# Altium project RZS_TestBench.PrjPcb
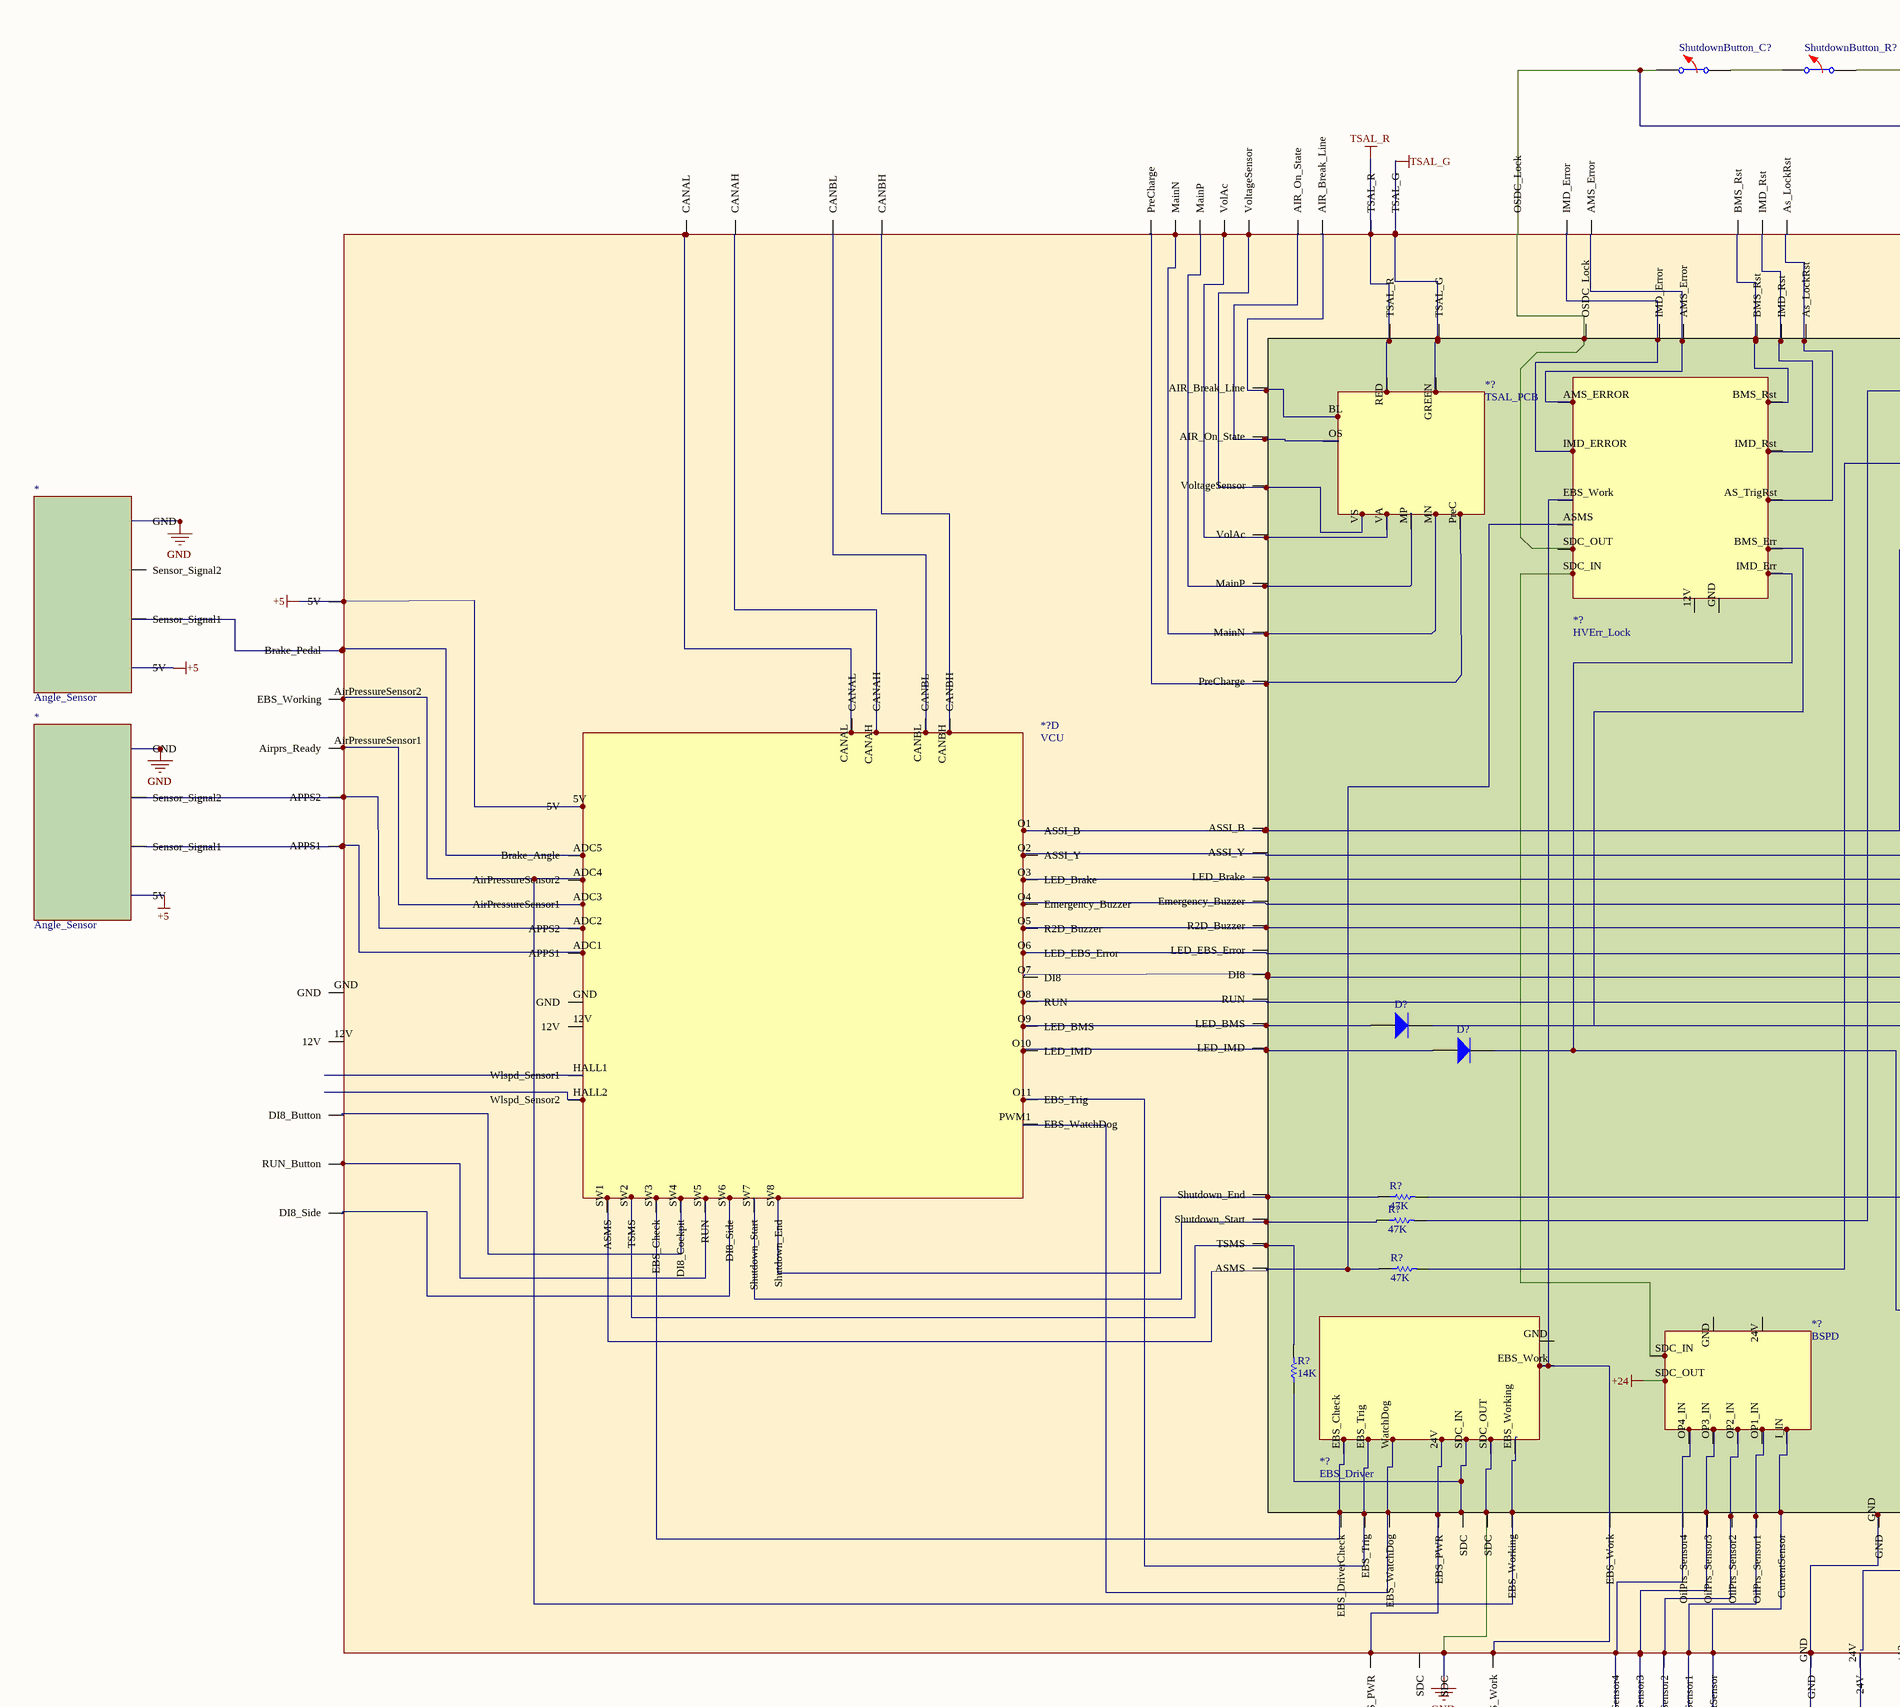
[diagram p0: Bench.SchDoc, top left]
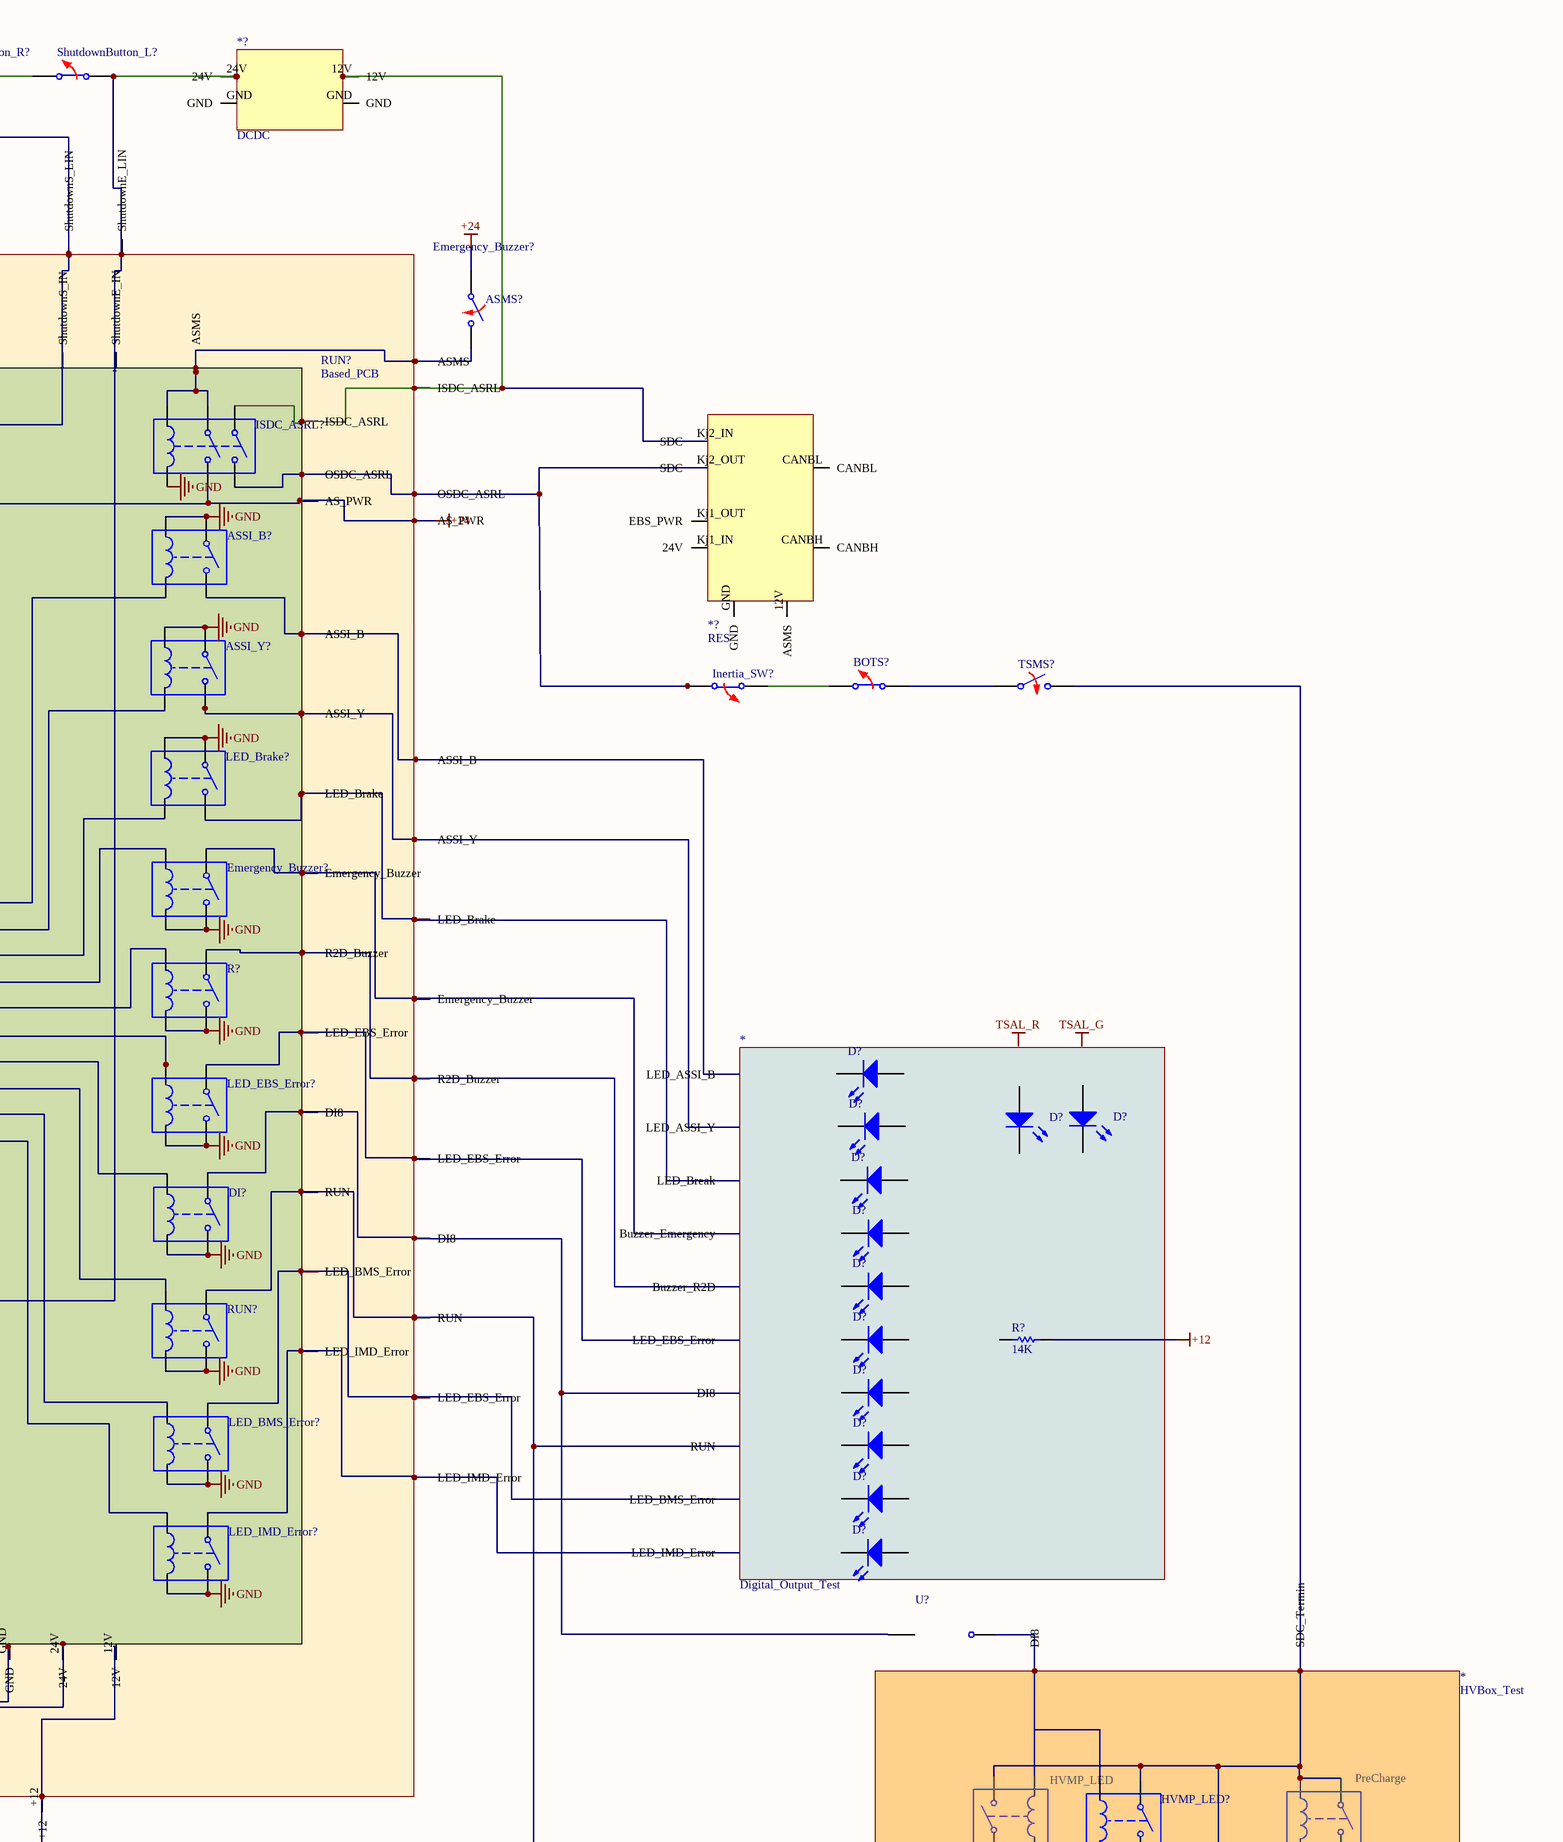
[diagram p1: Bench.SchDoc, top right]
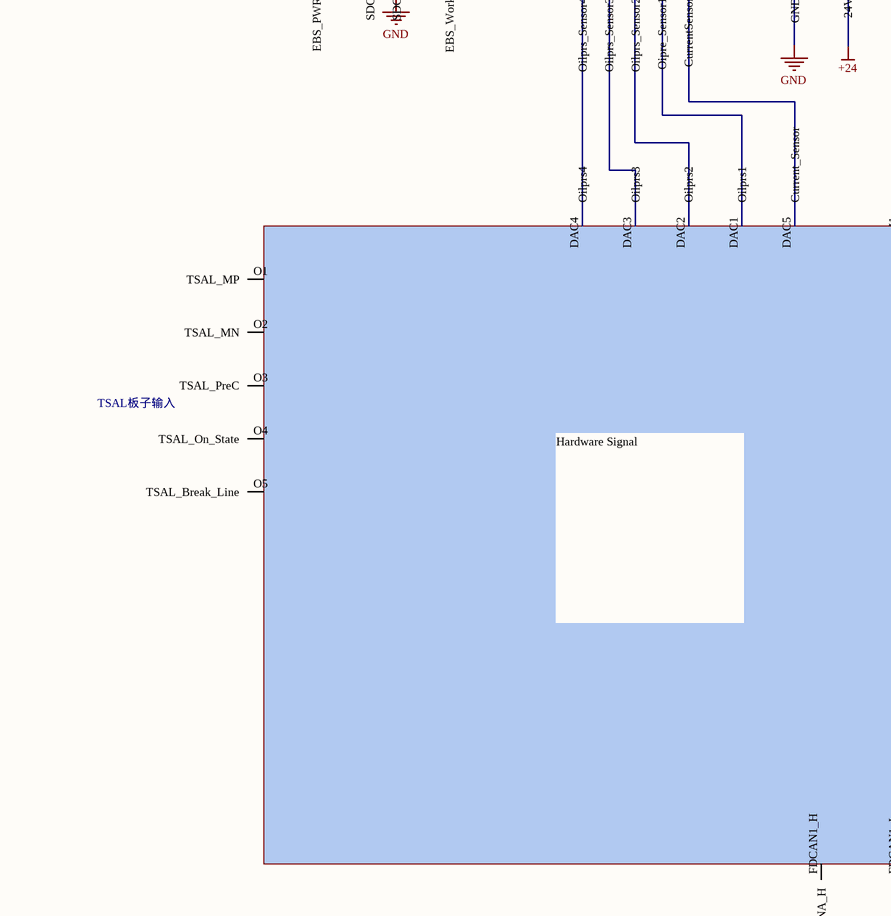
[diagram p2: Bench.SchDoc, bottom left]
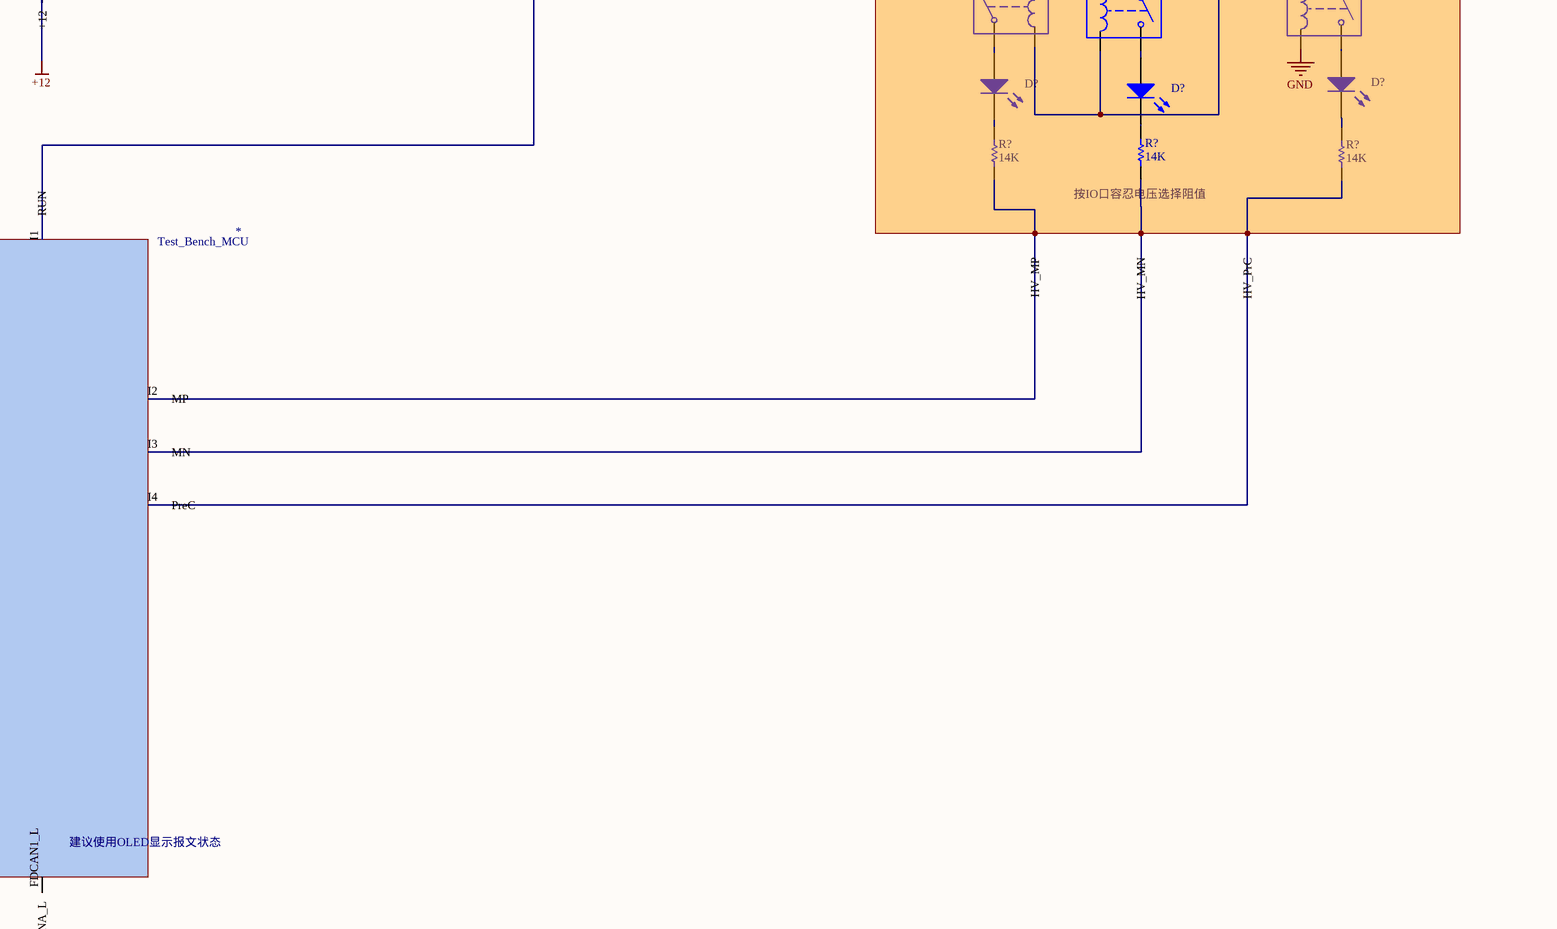
[diagram p3: Bench.SchDoc, bottom right]
7 sheets, 251 parts. Net scope: flat (ports and power ports of the same name join across sheets).
Sheets:
  Bench.SchDoc
  箱外驱动系统.SchDoc
  电池箱内部原理图.SchDoc
  安全回路.SchDoc
  充电安全回路.SchDoc
  TSAL分布图.SchDoc
  电气拓扑.SchDoc

## Sheet Bench.SchDoc
size 800 x 800 mm; SheetNumber: 1; SheetTotal: 1

### Parts
(Parts that share a designator on the sheet are numbered #1, #2 ... from top to bottom, then left to right.)
*#1  Angle_Sensor
*#2  Angle_Sensor
*#3  Digital_Output_Test
*#4  HVBox_Test
*#5  Test_Bench_MCU
*?#1  DCDC
*?#2  RES
*?#3  TSAL_PCB
*?#4  HVErr_Lock
*?#5  VCU  (part D of 4)
*?#6  BSPD
*?#7  EBS_Driver
ASMS?  Switch Normally Opened  (value not drawn)
ASSI_B?  Single-Pole, Single-Throw Normally Opened Relay  (value not drawn)
ASSI_Y?  Single-Pole, Single-Throw Normally Opened Relay  (value not drawn)
BOTS?  Switch Normally Closed  (value not drawn)
D?#1  Light-Emitting Diode  (value not drawn)
D?#2  Light-Emitting Diode  (value not drawn)
D?#3  Light-Emitting Diode  (value not drawn)
D?#4  Diode  (value not drawn)
D?#5  Light-Emitting Diode  (value not drawn)
D?#6  Diode  (value not drawn)
D?#7  Light-Emitting Diode  (value not drawn)
D?#8  Light-Emitting Diode  (value not drawn)
D?#9  Light-Emitting Diode  (value not drawn)
D?#10  Light-Emitting Diode  (value not drawn)
D?#11  Light-Emitting Diode  (value not drawn)
D?#12  Light-Emitting Diode  (value not drawn)
D?#13  Light-Emitting Diode  (value not drawn)
D?#14  Light-Emitting Diode  (value not drawn)
D?#15  Light-Emitting Diode  (value not drawn)
D?#16  Light-Emitting Diode  (value not drawn)
D?#17  Light-Emitting Diode  (value not drawn)
DI?  Single-Pole, Single-Throw Normally Opened Relay  (value not drawn)
Emergency_Buzzer?#1  Single-Pole, Single-Throw Normally Opened Relay  (value not drawn)
Emergency_Buzzer?#2  (no value)
HVMP_LED  Single-Pole, Single-Throw Normally Opened Relay  (value not drawn)
HVMP_LED?  Single-Pole, Single-Throw Normally Opened Relay  (value not drawn)
Inertia_SW?  Switch Normally Closed  (value not drawn)
ISDC_ASRL?  Double-Pole, Single-Throw Relay  (value not drawn)
LED_BMS_Error?  Single-Pole, Single-Throw Normally Opened Relay  (value not drawn)
LED_Brake?  Single-Pole, Single-Throw Normally Opened Relay  (value not drawn)
LED_EBS_Error?  Single-Pole, Single-Throw Normally Opened Relay  (value not drawn)
LED_IMD_Error?  Single-Pole, Single-Throw Normally Opened Relay  (value not drawn)
PreCharge  Single-Pole, Single-Throw Normally Opened Relay  (value not drawn)
R?#1  Single-Pole, Single-Throw Normally Opened Relay  (value not drawn)
R?#2  value 47K  (hidden comment: Resistor)
R?#3  value 47K  (hidden comment: Resistor)
R?#4  value 14K  (hidden comment: Resistor)
R?#5  value 47K  (hidden comment: Resistor)
R?#6  value 14K  (hidden comment: Resistor)
R?#7  value 14K  (hidden comment: Resistor)
R?#8  value 14K  (hidden comment: Resistor)
R?#9  value 14K  (hidden comment: Resistor)
RUN?#1  Single-Pole, Single-Throw Normally Opened Relay  (value not drawn)
RUN?#2  Based_PCB
ShutdownButton_C?  Switch Normally Closed  (value not drawn)
ShutdownButton_L?  Switch Normally Closed  (value not drawn)
ShutdownButton_R?  Switch Normally Closed  (value not drawn)
TSMS?  Switch Normally Opened  (value not drawn)
U?  Digital NOT Gate  (value not drawn)

### Nets
+5: *#1.?1(5V) *#2.?1(5V) *?#5.5V Emergency_Buzzer?#2.?43(5V)
+12: Emergency_Buzzer?#2.+12 R?#4.1
+24: *?#6.SDC_OUT ASMS?.1 Emergency_Buzzer?#2.24V Emergency_Buzzer?#2.?27(AS_PWR) ISDC_ASRL?.4 R?#5.2
GND: *#1.?4(GND) *#2.?4(GND) *?#7.SDC_OUT ASSI_B?.1 ASSI_B?.3 ASSI_Y?.1 ASSI_Y?.3 DI?.2 DI?.4 Emergency_Buzzer?#1.2 Emergency_Buzzer?#1.4 Emergency_Buzzer?#2.?37(SDC) Emergency_Buzzer?#2.GND ISDC_ASRL?.6 LED_BMS_Error?.2 LED_BMS_Error?.4 LED_Brake?.1 LED_Brake?.3 LED_EBS_Error?.2 LED_EBS_Error?.4 LED_IMD_Error?.2 LED_IMD_Error?.4 PreCharge.4 R?#1.2 R?#1.4 RUN?#1.2 RUN?#1.4 RUN?#2.?2(SDC) RUN?#2.GND
TSAL_G: *?#3.GREEN Emergency_Buzzer?#2.?18(TSAL_G) RUN?#2.?27(TSAL_G)
TSAL_R: *?#3.RED Emergency_Buzzer?#2.?17(TSAL_R)
Net*#1_?2: *#1.?2(Sensor_Signal1) *?#5.ADC5(Brake_Angle) Emergency_Buzzer?#2.?1(Brake_Pedal)
Net*#2_?2: *#2.?2(Sensor_Signal1) *?#5.ADC1(APPS1) Emergency_Buzzer?#2.?3(APPS1)
Net*#2_?3: *#2.?3(Sensor_Signal2) *?#5.ADC2(APPS2) Emergency_Buzzer?#2.?2(APPS2)
Net*#3_?1: *#3.?1(LED_ASSI_B) ASSI_B?.2 Emergency_Buzzer?#2.?28(ASSI_B) RUN?#2.?37(ASSI_B)
Net*#3_?2: *#3.?2(LED_ASSI_Y) ASSI_Y?.2 Emergency_Buzzer?#2.?29(ASSI_Y) RUN?#2.?38(ASSI_Y)
Net*#3_?3: *#3.?3(LED_Break) Emergency_Buzzer?#2.?30(LED_Brake) LED_Brake?.2 RUN?#2.?39(LED_Brake)
Net*#3_?4: *#3.?4(Buzzer_Emergency) Emergency_Buzzer?#1.1 Emergency_Buzzer?#2.?31(Emergency_Buzzer) RUN?#2.?40(Emergency_Buzzer)
Net*#3_?5: *#3.?5(Buzzer_R2D) Emergency_Buzzer?#2.?32(R2D_Buzzer) R?#1.1 RUN?#2.?41(R2D_Buzzer)
Net*#3_?6: *#3.?6(LED_EBS_Error) Emergency_Buzzer?#2.?33(LED_EBS_Error) LED_EBS_Error?.1 RUN?#2.?42(LED_EBS_Error)
Net*#3_?7: *#3.?7(DI8) DI?.1 Emergency_Buzzer?#2.?34(DI8) RUN?#2.?43(DI8) U?.1
Net*#3_?8: *#3.?8(RUN) *#5.I1(RUN) Emergency_Buzzer?#2.?35(RUN) RUN?#1.1 RUN?#2.?44(RUN)
Net*#3_?9: *#3.?9(LED_BMS_Error) Emergency_Buzzer?#2.?50(LED_EBS_Error) LED_BMS_Error?.1
Net*#3_?10: *#3.?10(LED_IMD_Error) Emergency_Buzzer?#2.?51(LED_IMD_Error) LED_IMD_Error?.1
Net*#4_?1: *#4.?1(SDC_Termin) HVMP_LED.2 HVMP_LED.3 HVMP_LED?.1 HVMP_LED?.4 PreCharge.1 PreCharge.3 TSMS?.2
Net*#4_?2: *#4.?2(DI8) HVMP_LED.4 HVMP_LED?.3 U?.2
Net*#4_?3: *#4.?3(HV_MP) *#5.I2(MP) R?#7.2
Net*#4_?4: *#4.?4(HV_MN) *#5.I3(MN) R?#8.2
Net*#4_?5: *#4.?5(HV_PrC) *#5.I4(PreC) R?#9.2
Net*#5_DAC1: *#5.DAC1(Oilprs1) *?#6.OP1_IN Emergency_Buzzer?#2.?41(Oipre_Sensor1)
Net*#5_DAC2: *#5.DAC2(Oilprs2) *?#6.OP2_IN Emergency_Buzzer?#2.?46(Oilprs_Sensor2)
Net*#5_DAC3: *#5.DAC3(Oilprs3) *?#6.OP3_IN Emergency_Buzzer?#2.?40(Oilprs_Sensor3) RUN?#2.?48(OilPrs_Sensor3)
Net*#5_DAC4: *#5.DAC4(Oilprs4) *?#6.OP4_IN Emergency_Buzzer?#2.?47(Oilprs_Sensor4)
Net*#5_DAC5: *#5.DAC5(Current_Sensor) *?#6.I_IN Emergency_Buzzer?#2.?42(CurrentSensor) RUN?#2.?8(CurrentSensor)
Net*?#1_12V: *?#1.12V *?#2.Kj2_IN(SDC) Emergency_Buzzer?#2.?25(ISDC_ASRL) ISDC_ASRL?.1 RUN?#2.?35(ISDC_ASRL)
Net*?#1_24V: *?#1.24V Emergency_Buzzer?#2.?49(ShutdownE_LIN) R?#2.2 ShutdownButton_L?.2
Net*?#2_Kj2_OUT: *?#2.Kj2_OUT(SDC) Emergency_Buzzer?#2.?26(OSDC_ASRL) Inertia_SW?.2 ISDC_ASRL?.2 RUN?#2.?36(OSDC_ASRL)
Net*?#3_BL: *?#3.BL Emergency_Buzzer?#2.?16(AIR_Break_Line)
Net*?#3_MN: *?#3.MN Emergency_Buzzer?#2.?11(MainN)
Net*?#3_MP: *?#3.MP Emergency_Buzzer?#2.?12(MainP)
Net*?#3_OS: *?#3.OS Emergency_Buzzer?#2.?15(AIR_On_State)
Net*?#3_PreC: *?#3.PreC Emergency_Buzzer?#2.?10(PreCharge)
Net*?#3_VA: *?#3.VA Emergency_Buzzer?#2.?13(VolAc)
Net*?#3_VS: *?#3.VS Emergency_Buzzer?#2.?14(VoltageSensor)
Net*?#4_AMS_ERROR: *?#4.AMS_ERROR Emergency_Buzzer?#2.?20(AMS_Error)
Net*?#4_AS_TrigRst: *?#4.AS_TrigRst Emergency_Buzzer?#2.?22(As_LockRst)
Net*?#4_ASMS: *?#4.ASMS *?#5.SW1(ASMS) R?#5.1
Net*?#4_BMS_Err: *?#4.BMS_Err D?#4.2(K) LED_BMS_Error?.3
Net*?#4_BMS_Rst: *?#4.BMS_Rst Emergency_Buzzer?#2.?23(BMS_Rst) RUN?#2.?32(BMS_Rst)
Net*?#4_EBS_Work: *?#4.EBS_Work *?#7.EBS_Work Emergency_Buzzer?#2.?39(EBS_Work)
Net*?#4_IMD_Err: *?#4.IMD_Err D?#6.2(K) LED_IMD_Error?.3
Net*?#4_IMD_ERROR: *?#4.IMD_ERROR Emergency_Buzzer?#2.?21(IMD_Error)
Net*?#4_IMD_Rst: *?#4.IMD_Rst Emergency_Buzzer?#2.?44(IMD_Rst)
Net*?#4_SDC_IN: *?#4.SDC_IN *?#6.SDC_IN
Net*?#4_SDC_OUT: *?#4.SDC_OUT Emergency_Buzzer?#2.?19(OSDC_Lock) Emergency_Buzzer?#2.?48(ShutdownS_LIN) R?#3.2 RUN?#2.?30(OSDC_Lock) ShutdownButton_C?.1
Net*?#5_ADC4: *?#5.ADC4(AirPressureSensor2) RUN?#2.?6(EBS_Working)
Net*?#5_O1: *?#5.O1(ASSI_B) ASSI_B?.4 RUN?#2.?18(ASSI_B)
Net*?#5_O2: *?#5.O2(ASSI_Y) ASSI_Y?.4
Net*?#5_O3: *?#5.O3(LED_Brake) LED_Brake?.4
Net*?#5_O4: *?#5.O4(Emergency_Buzzer) Emergency_Buzzer?#1.3
Net*?#5_O5: *?#5.O5(R2D_Buzzer) R?#1.3
Net*?#5_O6: *?#5.O6(LED_EBS_Error) LED_EBS_Error?.3
Net*?#5_O8: *?#5.O8(RUN) RUN?#1.3
Net*?#5_O9: *?#5.O9(LED_BMS) D?#4.1(A)
Net*?#5_O10: *?#5.O10(LED_IMD) D?#6.1(A) RUN?#2.?57(LED_IMD)
Net*?#5_O11: *?#5.O11(EBS_Trig) *?#7.EBS_Trig
Net*?#5_PWM1: *?#5.PWM1(EBS_WatchDog) *?#7.WatchDog RUN?#2.?5(EBS_WatchDog)
Net*?#5_SW2: *?#5.SW2(TSMS) R?#6.2
Net*?#5_SW3: *?#5.SW3(EBS_Check) *?#7.EBS_Check RUN?#2.?3(EBS_DriverCheck)
Net*?#5_SW8: *?#5.SW8(Shutdown_End) R?#2.1 RUN?#2.?53(Shutdown_End)
Net*?#7_24V: *?#7.24V Emergency_Buzzer?#2.?36(EBS_PWR)
Net*?#7_SDC_IN: *?#7.SDC_IN R?#6.1 RUN?#2.?1(SDC)
NetASMS?_2: ASMS?.2 Emergency_Buzzer?#2.?24(ASMS) ISDC_ASRL?.3 ISDC_ASRL?.5 RUN?#2.?33(ASMS)
NetBOTS?_1: BOTS?.1 Inertia_SW?.1
NetBOTS?_2: BOTS?.2 TSMS?.1
NetD?#15_1: D?#15.1(A) HVMP_LED.1
NetD?#15_2: D?#15.2(K) R?#7.1
NetD?#16_1: D?#16.1(A) HVMP_LED?.2
NetD?#16_2: D?#16.2(K) R?#8.1
NetD?#17_1: D?#17.1(A) PreCharge.2
NetD?#17_2: D?#17.2(K) R?#9.1
NetDI?_3: DI?.3 RUN?#2.?24(DI8)
NetShutdownButton_C?_2: ShutdownButton_C?.2 ShutdownButton_R?.1
NetShutdownButton_L?_1: ShutdownButton_L?.1 ShutdownButton_R?.2

Not connected (* = marked no-connect by the designer): *#1 ?3(Sensor_Signal2); *#5 FDCAN1_H(CANA_H) FDCAN1_L(CANA_L) O1(TSAL_MP) O2(TSAL_MN) O3(TSAL_PreC) O4(TSAL_On_State) O5(TSAL_Break_Line); *?#1 GND; *?#2 12V(ASMS) CANBH CANBL GND Kj1_IN(24V) Kj1_OUT(EBS_PWR); *?#4 12V GND; *?#5 12V ADC3(AirPressureSensor1) CANAH CANAL CANBH CANBL GND HALL1(Wlspd_Sensor1) HALL2(Wlspd_Sensor2) O7(DI8) SW4(DI8_Cockpit) SW5(RUN) SW6(DI8_Side) SW7(Shutdown_Start); *?#6 24V GND; *?#7 EBS_Working GND; D?#1 1(A) 2(K); D?#2 1(A) 2(K); D?#3 1(A) 2(K); D?#5 1(A) 2(K); D?#7 1(A) 2(K); D?#8 1(A) 2(K); D?#9 1(A) 2(K); D?#10 1(A) 2(K); D?#11 1(A) 2(K); D?#12 1(A) 2(K); D?#13 1(A) 2(K); D?#14 1(A) 2(K); Emergency_Buzzer?#2 12V ?4(DI8_Button) ?5(RUN_Button) ?6(CANAL) ?7(CANAH) ?8(CANBL) ?9(CANBH) ?38(SDC) ?45(DI8_Side) AirPressureSensor1(Airprs_Ready) AirPressureSensor2(EBS_Working); R?#3 1; R?#4 2; RUN?#2 12V 24V ?4(EBS_Trig) ?7(EBS_Work) ?9(OilPrs_Sensor1) ?10(OilPrs_Sensor2) ?11(AIR_Break_Line) ?12(AIR_On_State) ?13(VoltageSensor) ?14(VolAc) ?15(MainP) ?16(MainN) ?17(PreCharge) ?19(ASSI_Y) ?20(LED_Brake) ?21(Emergency_Buzzer) ?22(R2D_Buzzer) ?23(LED_EBS_Error) ?25(RUN) ?26(TSAL_R) ?28(IMD_Error) ?29(AMS_Error) ?31(IMD_Rst) ?34(AS_PWR) ?45(EBS_PWR) ?46(ASMS) ?47(TSMS) ?49(OilPrs_Sensor4) ?50(ShutdownS_IN) ?51(ShutdownE_IN) ?52(Shutdown_Start) ?54(LED_BMS_Error) ?55(LED_IMD_Error) ?56(LED_BMS) ?58(As_LockRst)

### Notes on the sheet
- (near *#4) 按IO口容忍电压选择阻值
- TSAL板子输入
- (near *#5) Hardware Signal
- Labels drawn without touching a wire or pin: TSAL_G, TSAL_R
- (in symbol Test_Bench_MCU) 建议使用OLED显示报文状态

### Library data of the parts
ASMS? TSMS? = SW NO: closed: 0; Rclosed: 1m; Ropen: 1Meg; SimulationGenericComponent: True
ASSI_B? ASSI_Y? DI? Emergency_Buzzer?#1 HVMP_LED HVMP_LED? LED_BMS_Error? LED_Brake? LED_EBS_Error? LED_IMD_Error? PreCharge R?#1 RUN?#1 = SPST Relay NO: L_C: 1u; R_C: 100; RON: 1; ROFF: 1e12; ION: 1m; IOFF: 0; SimulationGenericComponent: True
BOTS? Inertia_SW? ShutdownButton_C? ShutdownButton_L? ShutdownButton_R? = SW NC: closed: 1; Rclosed: 1m; Ropen: 1Meg; SimulationGenericComponent: True
D?#1-D?#3 D?#5 D?#7-D?#17 = LED: AF: 1; BV: 0; BV_MAX: 1e99; EG: 1.11; FC: 0.5; IBV: 0.001; IS: 1e-14; MJSW: 0.33; NTUN: 30; TNOM: 27; XTI: 3; SimulationGenericComponent: True; CJO: 0; CJP: 0; CTA: 0; CTP: 0; FCS: 0.5; FV_MAX: 1e99; IKF: 0; IKR: 0; ISR: 1e-14; JSW: 0; JTUN: 0; JTUNSW: 0; KEG: 1; KF: 0; LEVEL: 1; N: 1; NBV: 1; NR: 1; NS: 1; PHP: 1; RS: 0; TCV: 0; TLEV: 0; TLEVC: 0; TM1: 0; TM2: 0; TPB: 0; TPHP: 0; TRS: 0; TRS2: 0; TT: 0; TTT1: 0; TTT2: 0; VJ: 1; XTITUN: 3
D?#4 D?#6 = Diode: AF: 1; BV: 0; BV_MAX: 1e99; EG: 1.11; FC: 0.5; IBV: 0.001; ISR: 1e-14; MJSW: 0.33; NTUN: 30; TNOM: 27; XTI: 3; SimulationGenericComponent: True; CJO: 0; CJP: 0; CTA: 0; CTP: 0; FCS: 0.5; FV_MAX: 1e99; IKF: 0; IKR: 0; JSW: 0; JTUN: 0; JTUNSW: 0; KEG: 1; KF: 0; LEVEL: 1; N: 1; NBV: 1; NR: 1; NS: 1; PHP: 1; RS: 0; TCV: 0; TLEV: 0; TLEVC: 0; TM1: 0; TM2: 0; TPB: 0; TPHP: 0; TRS: 0; TRS2: 0; TT: 0; TTT1: 0; TTT2: 0; VJ: 1; XTITUN: 3; IS: 1e-14
Emergency_Buzzer?#2 = Low_Vol_Box_New
ISDC_ASRL? = DPST Relay: L_C: 1u; R_C: 100; RON: 1; ROFF: 1e12; ION: 1m; IOFF: 0; SimulationGenericComponent: True
R?#2-R?#9 = Resistor: TC1: 0; SimulationGenericComponent: True; TC2: 0
U? = Digital NOT: rise_delay_inst: 1n; input_load_inst: 1p; SimulationGenericComponent: True; fall_delay_inst: 1n

## Sheet 箱外驱动系统.SchDoc
size A4; SheetNumber: 2; SheetTotal: 9
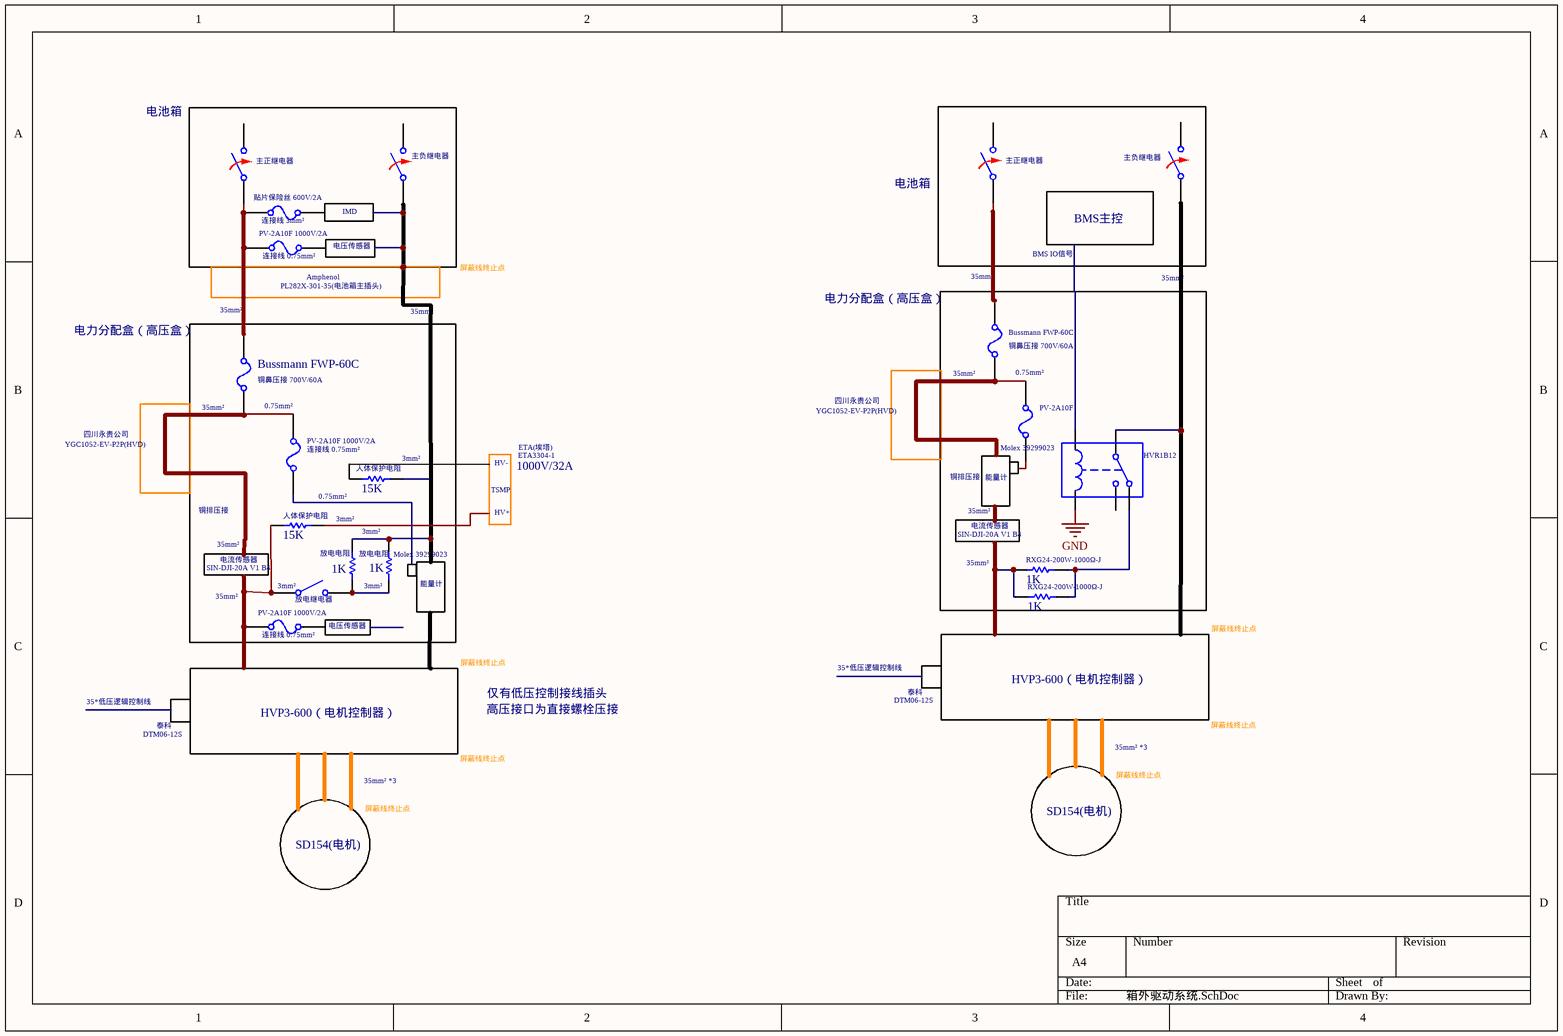
[diagram p4: 箱外驱动系统.SchDoc]

### Parts
(Parts that share a designator on the sheet are numbered #1, #2 ... from top to bottom, then left to right.)
Bussmann_FWP-60C#1  CURRENT: 铜鼻压接 700V/60A  (hidden comment: Fuse)
Bussmann_FWP-60C#2  CURRENT: 铜鼻压接 700V/60A  (hidden comment: Fuse)
HVR1B12  Single-Pole, Double-Throw Relay  (value not drawn)
PV-2A10F  连接线 0.75mm²  (value not drawn)
PV-2A10F_1000V/2A#1  连接线 0.75mm²
PV-2A10F_1000V/2A#2  连接线 0.75mm²
PV-2A10F_1000V/2A#3  连接线 0.75mm²
RXG24-200W-1000Ω-J#1  value 1K  (hidden comment: Resistor)
RXG24-200W-1000Ω-J#2  value 1K  (hidden comment: Resistor)
主正继电器#1  Switch Normally Opened  (value not drawn)
主正继电器#2  Switch Normally Opened  (value not drawn)
主负继电器#1  Switch Normally Opened  (value not drawn)
主负继电器#2  Switch Normally Opened  (value not drawn)
人体保护电阻#1  value 15K  (hidden comment: Resistor)
人体保护电阻#2  value 15K  (hidden comment: Resistor)
放电电阻#1  value 1K  (hidden comment: Resistor)
放电电阻#2  value 1K  (hidden comment: Resistor)
放电继电器#1  Single-Pole, Single-Throw Switch  (value not drawn)
贴片保险丝_600V/2A  连接线 3mm²

### Sub-sheets
电池箱 = 电池箱 (file not in this document): no entries
电池箱 = 电力分配盒（高压盒） (file not in this document): no entries
电池箱 = IMD (file not in this document): no entries
电池箱 = 电压传感器 (file not in this document): no entries
电池箱 = YGC1052-EV-P2P(HVD) (file not in this document): no entries
电池箱 = PL282X-301-35(电池箱主插头) (file not in this document): no entries
电池箱 = 能量计 (file not in this document): no entries
电池箱 = TSMP (file not in this document): no entries
电池箱 = HVP3-600（电机控制器） (file not in this document): no entries
电池箱 = 电压传感器 (file not in this document): no entries
电池箱 = 电池箱 (file not in this document): no entries
电池箱 = 电力分配盒（高压盒） (file not in this document): no entries
电池箱 = YGC1052-EV-P2P(HVD) (file not in this document): no entries
电池箱 = 能量计 (file not in this document): no entries
电池箱 = HVP3-600（电机控制器） (file not in this document): no entries

### Nets
GND: HVR1B12.5
NetBussmann_FWP-60C#1_1: Bussmann_FWP-60C#1.1 主正继电器#1.1
NetBussmann_FWP-60C#1_2: Bussmann_FWP-60C#1.2 PV-2A10F.2
NetBussmann_FWP-60C#2_1: Bussmann_FWP-60C#2.1 PV-2A10F_1000V/2A#1.1 主正继电器#2.1 贴片保险丝_600V/2A.1
NetBussmann_FWP-60C#2_2: Bussmann_FWP-60C#2.2 PV-2A10F_1000V/2A#2.2
NetHVR1B12_1: HVR1B12.1 主负继电器#1.1
NetHVR1B12_3: HVR1B12.3 RXG24-200W-1000Ω-J#1.1 RXG24-200W-1000Ω-J#2.1
NetPV-2A10F_1000V/2A#3_1: PV-2A10F_1000V/2A#3.1 人体保护电阻#2.2 放电继电器#1.1
NetRXG24-200W-1000Ω-J#1_2: RXG24-200W-1000Ω-J#1.2 RXG24-200W-1000Ω-J#2.2
Net主负继电器#2_1: 主负继电器#2.1 放电电阻#1.2 放电电阻#2.2
Net放电电阻#1_1: 放电电阻#1.1 放电电阻#2.1 放电继电器#1.2

Not connected (* = marked no-connect by the designer): HVR1B12 2 4; PV-2A10F 1; PV-2A10F_1000V/2A#1 2; PV-2A10F_1000V/2A#2 1; PV-2A10F_1000V/2A#3 2; 主正继电器#1 2; 主正继电器#2 2; 主负继电器#1 2; 主负继电器#2 2; 人体保护电阻#1 1 2; 人体保护电阻#2 1; 贴片保险丝_600V/2A 2

### Notes on the sheet
- BMS主控
- 35mm²
- (near PV-2A10F_1000V/2A#1) Amphenol
- 屏蔽线终止点
- (near Bussmann_FWP-60C#1) 35mm²
- BMS IO信号
- 0.75mm²
- 四川永贵公司
- (near Bussmann_FWP-60C#2) 35mm²
- ETA(埃塔)
- (near PV-2A10F) Molex 39299023
- 铜排压接
- (near 人体保护电阻#1) 0.75mm²
- 3mm²
- (near 人体保护电阻#1) 3mm²
- HV+
- HV-
- 1000V/32A
- ETA3304-1
- SIN-DJI-20A V1 B4
- 电流传感器
- (near 放电继电器#1) 3mm²
- (near 放电电阻#1) 3mm²
- (near 放电电阻#2) 3mm²
- (near 放电电阻#2) Molex 39299023
- (near RXG24-200W-1000Ω-J#1) SIN-DJI-20A V1 B4
- (near RXG24-200W-1000Ω-J#1) 35mm²
- (near RXG24-200W-1000Ω-J#1) 电流传感器
- 35*低压逻辑控制线
- 高压接口为直接螺栓压接
- 仅有低压控制接线插头
- DTM06-12S
- 泰科
- 35mm² *3
- SD154(电机)

### Library data of the parts
Bussmann_FWP-60C#1 Bussmann_FWP-60C#2 = Fuse: RESISTANCE: 1m; SimulationGenericComponent: True
HVR1B12 = SPDT Relay: L_C: 1u; R_C: 100; RON: 1; ROFF: 1e12; ION: 1m; IOFF: 0; SimulationGenericComponent: True
PV-2A10F PV-2A10F_1000V/2A#1-PV-2A10F_1000V/2A#3 贴片保险丝_600V/2A = Fuse: RESISTANCE: 1m; SimulationGenericComponent: True; CURRENT: 1
RXG24-200W-1000Ω-J#1 RXG24-200W-1000Ω-J#2 人体保护电阻#1 人体保护电阻#2 放电电阻#1 放电电阻#2 = Resistor: TC1: 0; SimulationGenericComponent: True; TC2: 0
主正继电器#1 主正继电器#2 主负继电器#1 主负继电器#2 = SW NO: as ASMS? on sheet Bench
放电继电器#1 = SPST SW: closed: 0; Rclosed: 1m; Ropen: 1Meg; SimulationGenericComponent: True

## Sheet 电池箱内部原理图.SchDoc
size A4; SheetNumber: 3; SheetTotal: 9
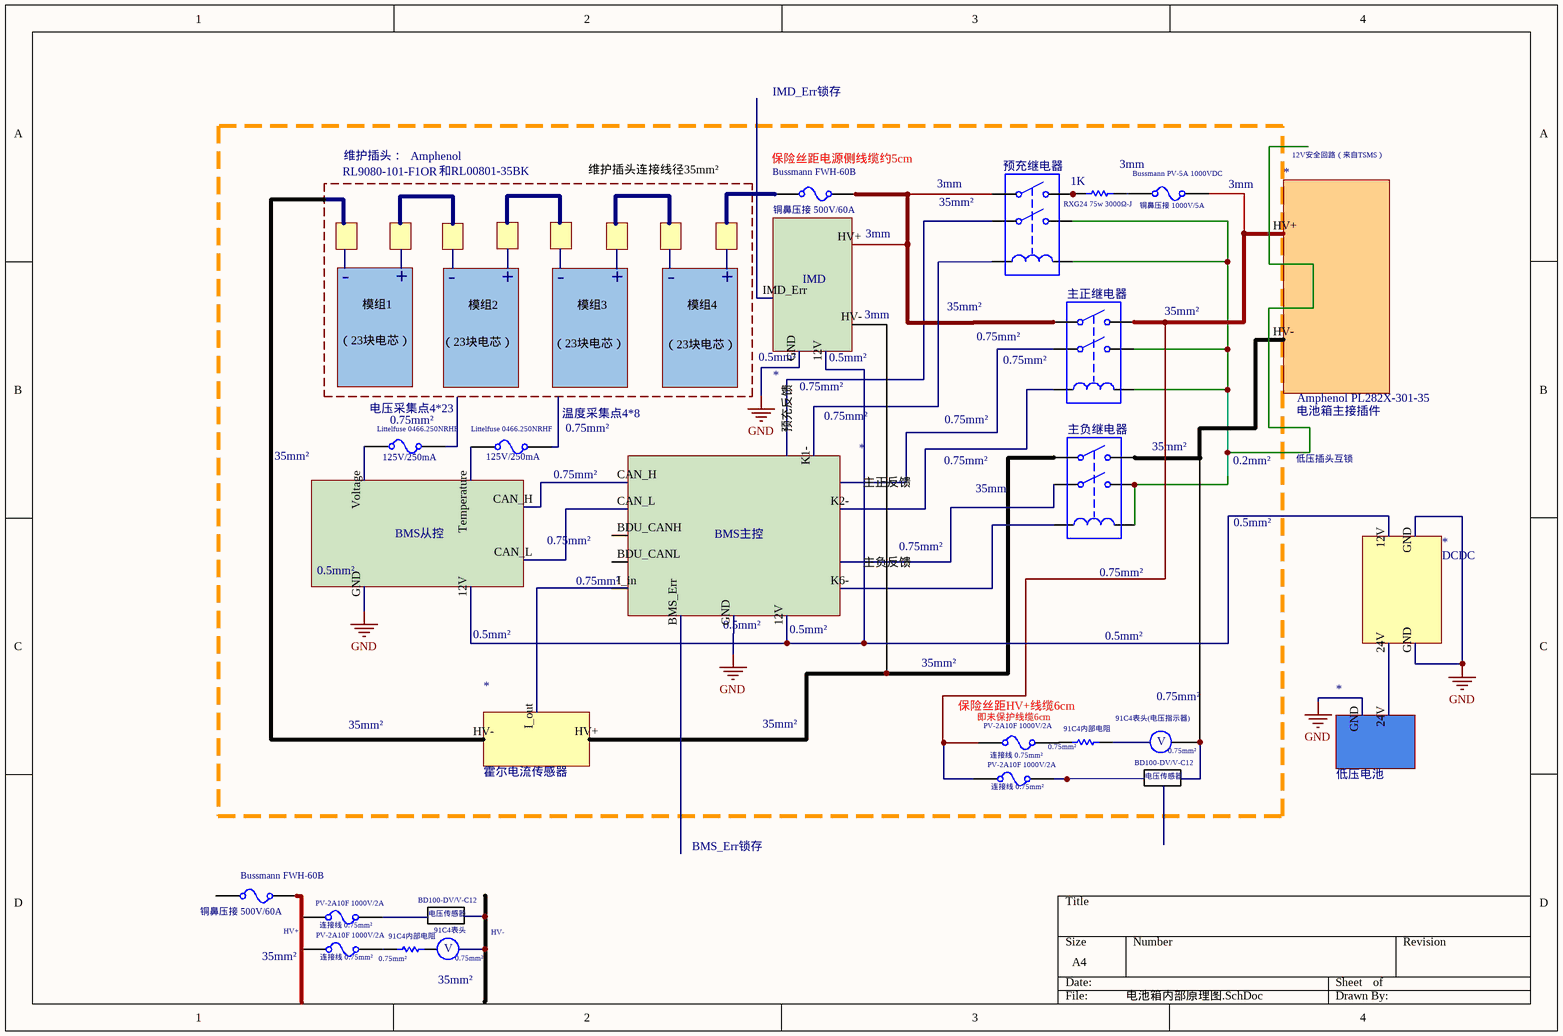
[diagram p5: 电池箱内部原理图.SchDoc]

### Parts
(Parts that share a designator on the sheet are numbered #1, #2 ... from top to bottom, then left to right.)
91C4内部电阻#1  Resistor  (value not drawn)
91C4内部电阻#2  Resistor  (value not drawn)
*#6  IMD
*#7  Amphenol PL282X-301-35
*#8  BMS从控
*#9  BMS主控
*#10  DCDC
*#11  霍尔电流传感器
*#12  低压电池
Bussmann_FWH-60B#1  Fuse  (value not drawn)
Bussmann_FWH-60B#2  Fuse  (value not drawn)
Bussmann_PV-5A_1000VDC#1  Fuse  (value not drawn)
Littelfuse_0466.250NRHF#1  CURRENT: 125V/250mA  (hidden comment: Fuse)
Littelfuse_0466.250NRHF#2  CURRENT: 125V/250mA  (hidden comment: Fuse)
PV-2A10F_1000V/2A#4  连接线 0.75mm²
PV-2A10F_1000V/2A#5  连接线 0.75mm²
PV-2A10F_1000V/2A#6  连接线 0.75mm²
PV-2A10F_1000V/2A#7  连接线 0.75mm²
RXG24_75w_3000Ω-J#1  value 1K  (hidden comment: Resistor)
主正继电器#3  Double-Pole, Single-Throw Relay  (value not drawn)
主负继电器#3  Double-Pole, Single-Throw Relay  (value not drawn)
预充继电器#1  Double-Pole, Single-Throw Relay  (value not drawn)

### Nets
GND: *#6.GND *#8.GND *#9.GND *#10.GND *#12.GND
Net91C4内部电阻#2_1: 91C4内部电阻#2.1 PV-2A10F_1000V/2A#7.2
Net*#6_12V: *#6.12V *#8.12V *#9.12V *#10.12V
Net*#6_HV+: *#6.HV+ Bussmann_FWH-60B#1.2 主正继电器#3.1 预充继电器#1.1
Net*#6_HV-: *#6.HV- *#11.HV+ 主负继电器#3.1
Net*#7_HV+: *#7.HV+ Bussmann_PV-5A_1000VDC#1.2 PV-2A10F_1000V/2A#4.1 PV-2A10F_1000V/2A#5.1 主正继电器#3.2
Net*#7_HV-: *#7.HV- 主负继电器#3.2
Net*#8_CAN_H: *#8.CAN_H *#9.CAN_H
Net*#8_CAN_L: *#8.CAN_L *#9.CAN_L
Net*#8_Temperature: *#8.Temperature Littelfuse_0466.250NRHF#2.1
Net*#8_Voltage: *#8.Voltage Littelfuse_0466.250NRHF#1.1
Net*#9_?1: *#9.?1(主负反馈) 主负继电器#3.3
Net*#9_?2: *#9.?2(主正反馈) 主正继电器#3.3
Net*#9_?3: *#9.?3(预充反馈) 预充继电器#1.3
Net*#9_I_in: *#9.I_in *#11.I_out
Net*#9_K1-: *#9.K1- 预充继电器#1.5
Net*#9_K2-: *#9.K2- 主正继电器#3.5
Net*#9_K6-: *#9.K6- 主负继电器#3.5
Net*#10_24V: *#10.24V *#12.24V
NetBussmann_FWH-60B#2_1: Bussmann_FWH-60B#2.1 PV-2A10F_1000V/2A#6.1 PV-2A10F_1000V/2A#7.1
NetBussmann_PV-5A_1000VDC#1_1: Bussmann_PV-5A_1000VDC#1.1 RXG24_75w_3000Ω-J#1.2
NetRXG24_75w_3000Ω-J#1_1: RXG24_75w_3000Ω-J#1.1 预充继电器#1.2
Net主正继电器#3_4: 主正继电器#3.4 主正继电器#3.6 主负继电器#3.4 主负继电器#3.6 预充继电器#1.4 预充继电器#1.6

Not connected (* = marked no-connect by the designer): 91C4内部电阻#1 1 2; 91C4内部电阻#2 2; *#6 IMD_Err; *#9 BDU_CANH BDU_CANL BMS_Err; *#11 HV-; Bussmann_FWH-60B#1 1; Bussmann_FWH-60B#2 2; Littelfuse_0466.250NRHF#1 2; Littelfuse_0466.250NRHF#2 2; PV-2A10F_1000V/2A#4 2; PV-2A10F_1000V/2A#5 2; PV-2A10F_1000V/2A#6 2

### Notes on the sheet
- IMD_Err锁存
- RL9080-101-F1OR
- 维护插头：
- Amphenol
- 和RL00801-35BK
- 维护插头连接线径35mm²
- (near Bussmann_FWH-60B#1) 保险丝距电源侧线缆约5cm
- 3mm
- 12V安全回路（来自TSMS）
- (near Bussmann_FWH-60B#1) 铜鼻压接 500V/60A
- (near *#6) 3mm
- (near 预充继电器#1) 35mm²
- (near Bussmann_PV-5A_1000VDC#1) 铜鼻压接 1000V/5A
- -
- 模组1
- +
- 模组2
- 模组3
- (near *#6) 模组4
- (near *#6) +
- 35mm²
- （23块电芯）
- (near *#6) （23块电芯）
- (near *#6) 0.5mm²
- 0.75mm²
- (near 主正继电器#3) 0.75mm²
- 电压采集点4*23
- (near Littelfuse_0466.250NRHF#1) 0.75mm²
- (near *#9) 温度采集点4*8
- (near *#9) 0.75mm²
- (near *#6) 0.75mm²
- (near 主负继电器#3) 35mm²
- 电池箱主接插件
- (near *#8) 0.75mm²
- 0.2mm²
- 低压插头互锁
- (near *#8) 0.5mm²
- (near 主负继电器#3) 0.75mm²
- 0.5mm²
- (near *#9) 0.5mm²
- (near PV-2A10F_1000V/2A#4) 保险丝距HV+线缆6cm
- (near PV-2A10F_1000V/2A#4) 即未保护线缆6cm
- (near 91C4内部电阻#1) 91C4表头(电压指示器)
- (near 91C4内部电阻#1) 0.75mm²
- (near 91C4内部电阻#1) BD100-DV/V-C12
- 电压传感器
- V
- BMS_Err锁存
- (near Bussmann_FWH-60B#2) 铜鼻压接 500V/60A
- BD100-DV/V-C12
- (near 91C4内部电阻#2) 电压传感器
- (near PV-2A10F_1000V/2A#7) 35mm²
- HV+
- (near 91C4内部电阻#2) 0.75mm²
- (near 91C4内部电阻#2) 91C4表头
- (near 91C4内部电阻#2) 35mm²
- (near 91C4内部电阻#2) V
- HV-

### Library data of the parts
91C4内部电阻#1 91C4内部电阻#2 = Resistor: TC1: 0; SimulationGenericComponent: True; Value: 1K; TC2: 0
Bussmann_FWH-60B#1 Bussmann_FWH-60B#2 Bussmann_PV-5A_1000VDC#1 PV-2A10F_1000V/2A#4-PV-2A10F_1000V/2A#7 = Fuse: as PV-2A10F on sheet 箱外驱动系统
Littelfuse_0466.250NRHF#1 Littelfuse_0466.250NRHF#2 = Fuse: as Bussmann_FWP-60C#1 on sheet 箱外驱动系统
RXG24_75w_3000Ω-J#1 = Resistor: TC1: 0; SimulationGenericComponent: True; TC2: 0
主正继电器#3 主负继电器#3 预充继电器#1 = DPST Relay: as ISDC_ASRL? on sheet Bench

## Sheet 安全回路.SchDoc
size A4; SheetNumber: 4; SheetTotal: 9
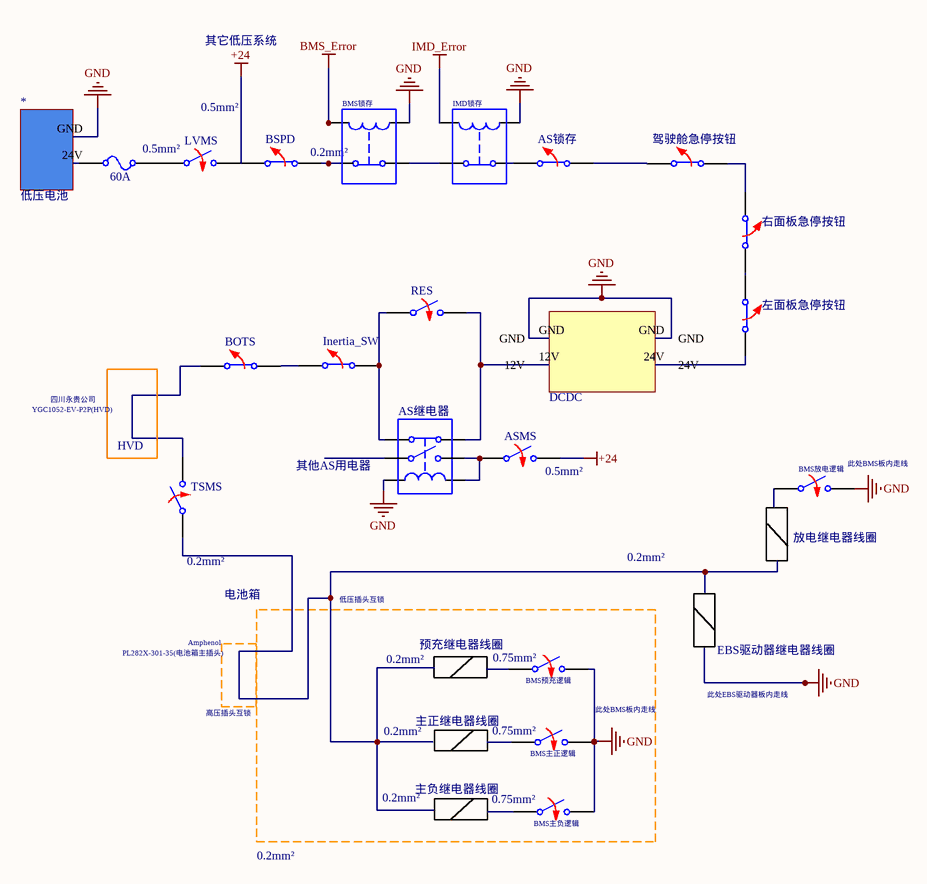
[diagram p6: 安全回路.SchDoc]

### Parts
(Parts that share a designator on the sheet are numbered #1, #2 ... from top to bottom, then left to right.)
60A  Fuse  (value not drawn)
*#13  低压电池
*?#8  DCDC
ASMS#1  Switch Normally Opened  (value not drawn)
AS继电器  Single-Pole, Single-Throw Normally Closed Relay  (value not drawn)
AS锁存  Switch Normally Closed  (value not drawn)
BMS主正逻辑  Switch Normally Opened  (value not drawn)
BMS主负逻辑  Switch Normally Opened  (value not drawn)
BMS放电逻辑  Switch Normally Opened  (value not drawn)
BMS锁存  Single-Pole, Single-Throw Normally Closed Relay  (value not drawn)
BMS预充逻辑  Switch Normally Opened  (value not drawn)
BOTS#1  Switch Normally Closed  (value not drawn)
BSPD#1  Switch Normally Closed  (value not drawn)
IMD锁存  Single-Pole, Single-Throw Normally Closed Relay  (value not drawn)
Inertia_SW  Switch Normally Closed  (value not drawn)
LVMS#1  Switch Normally Opened  (value not drawn)
RES#1  Switch Normally Opened  (value not drawn)
S?  Single-Pole, Single-Throw Switch  (value not drawn)
TSMS#1  Switch Normally Opened  (value not drawn)
右面板急停按钮  Switch Normally Closed  (value not drawn)
左面板急停按钮  Switch Normally Closed  (value not drawn)
驾驶舱急停按钮  Switch Normally Closed  (value not drawn)

### Sub-sheets
电池箱 = YGC1052-EV-P2P(HVD) (file not in this document): no entries

### Nets
+24: ASMS#1.2 BSPD#1.1 LVMS#1.2
BMS_Error: BMS锁存.4
GND: *#13.GND *?#8.GND AS继电器.3 BMS主正逻辑.2 BMS主负逻辑.2 BMS放电逻辑.2 BMS锁存.3 BMS预充逻辑.2 IMD锁存.3
IMD_Error: IMD锁存.4
Net60A_1: 60A.1 *#13.24V
Net60A_2: 60A.2 LVMS#1.1
Net*?#8_12V: *?#8.12V AS继电器.2 RES#1.2
Net*?#8_24V: *?#8.24V 左面板急停按钮.2
NetASMS#1_1: ASMS#1.1 AS继电器.4 S?.2
NetAS继电器_1: AS继电器.1 Inertia_SW.2 RES#1.1
NetAS锁存_2: AS锁存.2 驾驶舱急停按钮.1
NetBMS锁存_1: BMS锁存.1 IMD锁存.2
NetBMS锁存_2: BMS锁存.2 BSPD#1.2
NetBOTS#1_1: BOTS#1.1 TSMS#1.2
NetBOTS#1_2: BOTS#1.2 Inertia_SW.1
Net右面板急停按钮_1: 右面板急停按钮.1 驾驶舱急停按钮.2
Net右面板急停按钮_2: 右面板急停按钮.2 左面板急停按钮.1

Not connected (* = marked no-connect by the designer): AS锁存 1; BMS主正逻辑 1; BMS主负逻辑 1; BMS放电逻辑 1; BMS预充逻辑 1; IMD锁存 1; S? 1; TSMS#1 1

### Notes on the sheet
- 其它低压系统
- 0.5mm²
- (near BMS锁存) 0.2mm²
- 四川永贵公司
- HVD
- (near BMS放电逻辑) 此处BMS板内走线
- 其他AS用电器
- (near ASMS#1) 0.5mm²
- (near TSMS#1) 0.2mm²
- 电池箱
- 低压插头互锁
- 0.2mm²
- (near BMS放电逻辑) 放电继电器线圈
- PL282X-301-35(电池箱主插头)
- Amphenol
- 预充继电器线圈
- (near BMS预充逻辑) 0.75mm²
- EBS驱动器继电器线圈
- 高压插头互锁
- 主正继电器线圈
- (near BMS主正逻辑) 0.75mm²
- 此处BMS板内走线
- 此处EBS驱动器板内走线
- 主负继电器线圈
- (near BMS主负逻辑) 0.75mm²

### Library data of the parts
60A = Fuse: as PV-2A10F on sheet 箱外驱动系统
ASMS#1 BMS主正逻辑 BMS主负逻辑 BMS放电逻辑 BMS预充逻辑 LVMS#1 RES#1 TSMS#1 = SW NO: as ASMS? on sheet Bench
AS继电器 BMS锁存 IMD锁存 = SPST Relay NC: L_C: 1u; R_C: 100; RON: 1; ROFF: 1e12; ION: 1m; IOFF: 0; SimulationGenericComponent: True
AS锁存 BOTS#1 BSPD#1 Inertia_SW 右面板急停按钮 左面板急停按钮 驾驶舱急停按钮 = SW NC: as BOTS? on sheet Bench
S? = SPST SW: as 放电继电器#1 on sheet 箱外驱动系统

## Sheet 充电安全回路.SchDoc
size A4; SheetNumber: 6; SheetTotal: 9
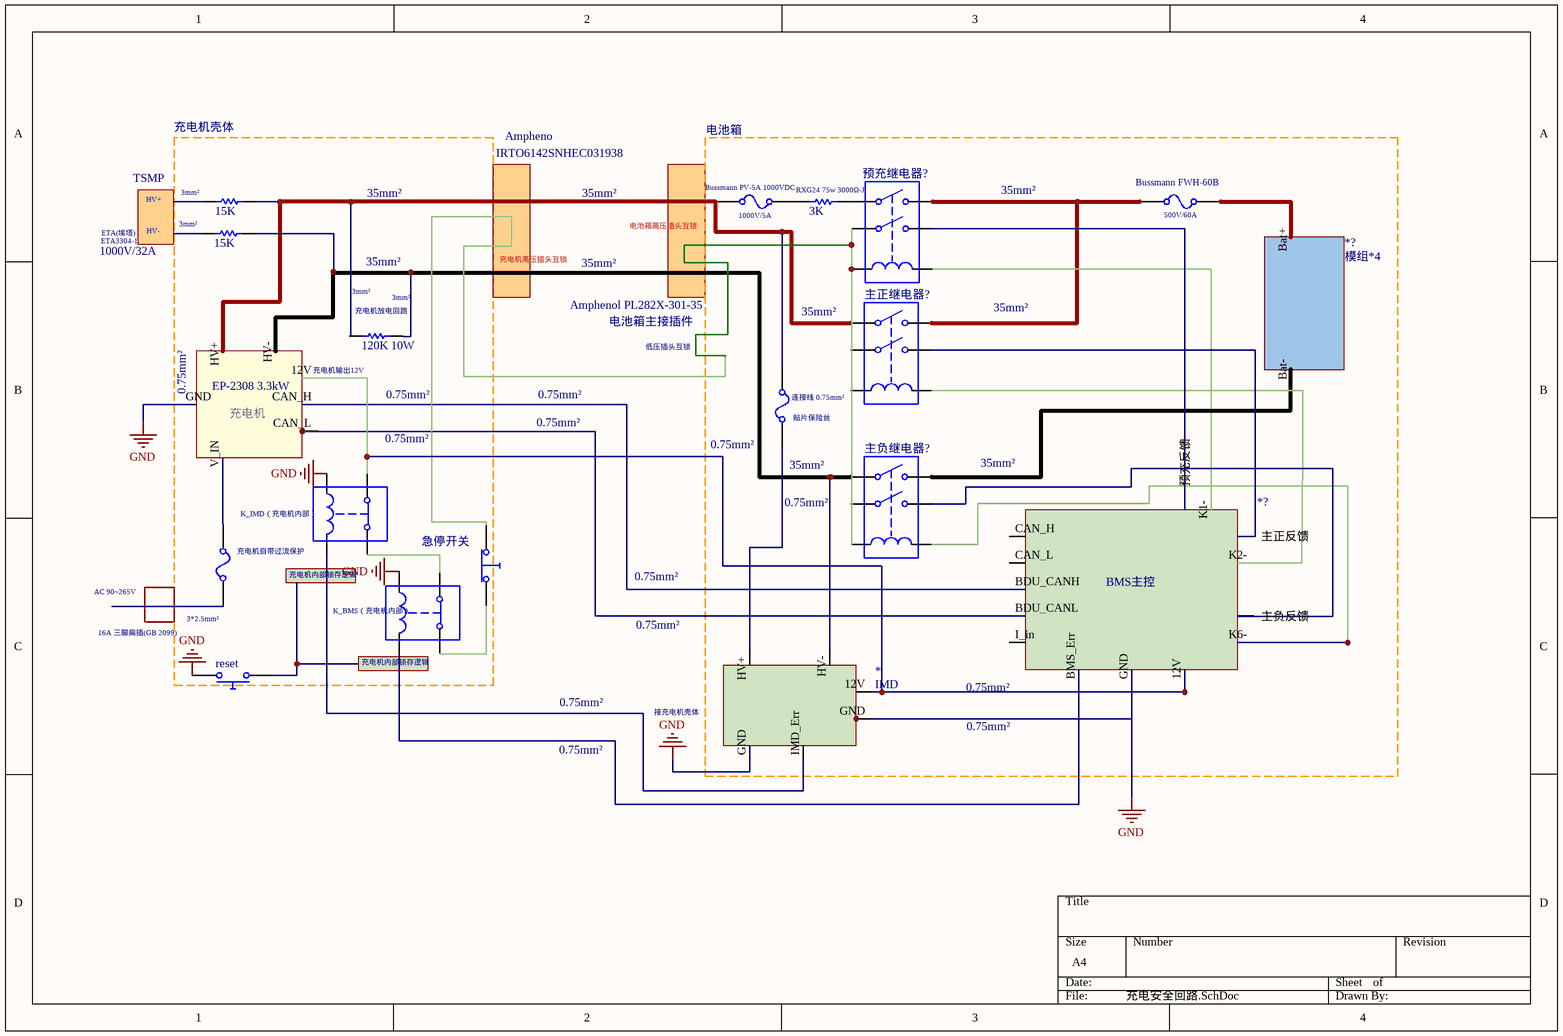
[diagram p7: 充电安全回路.SchDoc]

### Parts
(Parts that share a designator on the sheet are numbered #1, #2 ... from top to bottom, then left to right.)
*#14  IMD
*?#9  模组*4
*?#10  EP-2308 3.3kW
*?#11  BMS主控
?#1  value 120K 10W  (hidden comment: Resistor)
Bussmann_FWH-60B#3  Fuse  (value not drawn)
Bussmann_PV-5A_1000VDC#2  Fuse  (value not drawn)
K_BMS（充电机内部）  Single-Pole, Single-Throw Normally Closed Relay  (value not drawn)
K_IMD（充电机内部）  Single-Pole, Single-Throw Normally Closed Relay  (value not drawn)
R?#10  value 15K  (hidden comment: Resistor)
R?#11  value 15K  (hidden comment: Resistor)
reset  Push Button Normally Opened  (value not drawn)
RXG24_75w_3000Ω-J#2  value 3K  (hidden comment: Resistor)
主正继电器?#1  Double-Pole, Single-Throw Relay  (value not drawn)
主负继电器?#1  Double-Pole, Single-Throw Relay  (value not drawn)
充电机自带过流保护  Fuse  (value not drawn)
急停开关  Push Button Normally Closed  (value not drawn)
贴片保险丝  连接线 0.75mm²
预充继电器?#1  Double-Pole, Single-Throw Relay  (value not drawn)

### Nets
GND: *#14.GND *?#10.GND *?#11.GND K_BMS（充电机内部）.3 K_IMD（充电机内部）.3 reset.2
Net*#14_12V: *#14.12V *?#10.12V *?#11.12V K_IMD（充电机内部）.1
Net*#14_HV+: *#14.HV+ 贴片保险丝.1
Net*#14_HV-: *#14.HV- *?#10.HV- ?#1.2 R?#11.1 主负继电器?#1.1
Net*#14_IMD_Err: *#14.IMD_Err K_IMD（充电机内部）.4
Net*?#9_Bat+: *?#9.Bat+ Bussmann_FWH-60B#3.2
Net*?#9_Bat-: *?#9.Bat- 主负继电器?#1.2
Net*?#10_CAN_H: *?#10.CAN_H *?#11.BDU_CANH
Net*?#10_CAN_L: *?#10.CAN_L *?#11.BDU_CANL
Net*?#10_HV+: *?#10.HV+ ?#1.1 Bussmann_PV-5A_1000VDC#2.1 R?#10.2 主正继电器?#1.1 贴片保险丝.2
Net*?#10_V_IN: *?#10.V_IN 充电机自带过流保护.2
Net*?#11_?1: *?#11.?1(主负反馈) 主负继电器?#1.4
Net*?#11_?2: *?#11.?2(主正反馈) 主正继电器?#1.4
Net*?#11_?3: *?#11.?3(预充反馈) 预充继电器?#1.4
Net*?#11_BMS_Err: *?#11.BMS_Err K_BMS（充电机内部）.4
Net*?#11_K1-: *?#11.K1- 预充继电器?#1.6
Net*?#11_K2-: *?#11.K2- 主正继电器?#1.6
Net*?#11_K6-: *?#11.K6- 主负继电器?#1.6
NetBussmann_FWH-60B#3_1: Bussmann_FWH-60B#3.1 主正继电器?#1.2 预充继电器?#1.2
NetBussmann_PV-5A_1000VDC#2_2: Bussmann_PV-5A_1000VDC#2.2 RXG24_75w_3000Ω-J#2.1
NetK_BMS（充电机内部）_1: K_BMS（充电机内部）.1 K_IMD（充电机内部）.2
NetK_BMS（充电机内部）_2: K_BMS（充电机内部）.2 急停开关.2
NetRXG24_75w_3000Ω-J#2_2: RXG24_75w_3000Ω-J#2.2 预充继电器?#1.1
Net主负继电器?#1_5: 主负继电器?#1.5 急停开关.1 预充继电器?#1.3 预充继电器?#1.5

Not connected (* = marked no-connect by the designer): *?#11 CAN_H CAN_L I_in; R?#10 1; R?#11 2; reset 1; 主正继电器?#1 3 5; 主负继电器?#1 3; 充电机自带过流保护 1

### Notes on the sheet
- TSMP
- 充电机壳体
- IRTO6142SNHEC031938
- Ampheno
- 电池箱
- ETA3304-1
- ETA(埃塔)
- HV+
- HV-
- (near R?#11) 3mm²
- (near R?#10) 3mm²
- 35mm²
- 电池箱高压插头互锁
- (near Bussmann_PV-5A_1000VDC#2) 1000V/5A
- (near Bussmann_FWH-60B#3) 500V/60A
- 1000V/32A
- (near *?#10) 3mm²
- (near *?#10) 充电机放电回路
- 3mm²
- 充电机高压插头互锁
- Amphenol PL282X-301-35
- (near *?#10) 充电机输出12V
- 电池箱主接插件
- 低压插头互锁
- (near *?#10) 0.75mm²
- (near *?#10) 充电机
- 0.75mm²
- (near 贴片保险丝) 0.75mm²
- (near 主负继电器?#1) 0.75mm²
- (near *?#11) 35mm²
- (near K_IMD（充电机内部）) 充电机内部锁存逻辑
- AC 90~265V
- 16A 三脚扁插(GB 2099)
- 3*2.5mm²
- (near K_BMS（充电机内部）) 充电机内部锁存逻辑
- 接充电机壳体
- (near *?#11) 0.75mm²

### Library data of the parts
?#1 R?#10 R?#11 RXG24_75w_3000Ω-J#2 = Resistor: TC1: 0; SimulationGenericComponent: True; TC2: 0
Bussmann_FWH-60B#3 Bussmann_PV-5A_1000VDC#2 充电机自带过流保护 贴片保险丝 = Fuse: as PV-2A10F on sheet 箱外驱动系统
K_BMS（充电机内部） K_IMD（充电机内部） = SPST Relay NC: as AS继电器 on sheet 安全回路
reset = Push Button NO: closed: 0; Rclosed: 1m; Ropen: 1Meg; SimulationGenericComponent: True
主正继电器?#1 主负继电器?#1 预充继电器?#1 = DPST Relay: as ISDC_ASRL? on sheet Bench
急停开关 = Push Button NC: closed: 1; Rclosed: 1m; Ropen: 1Meg; SimulationGenericComponent: True

## Sheet TSAL分布图.SchDoc
size A4; SheetNumber: 7; SheetTotal: 9
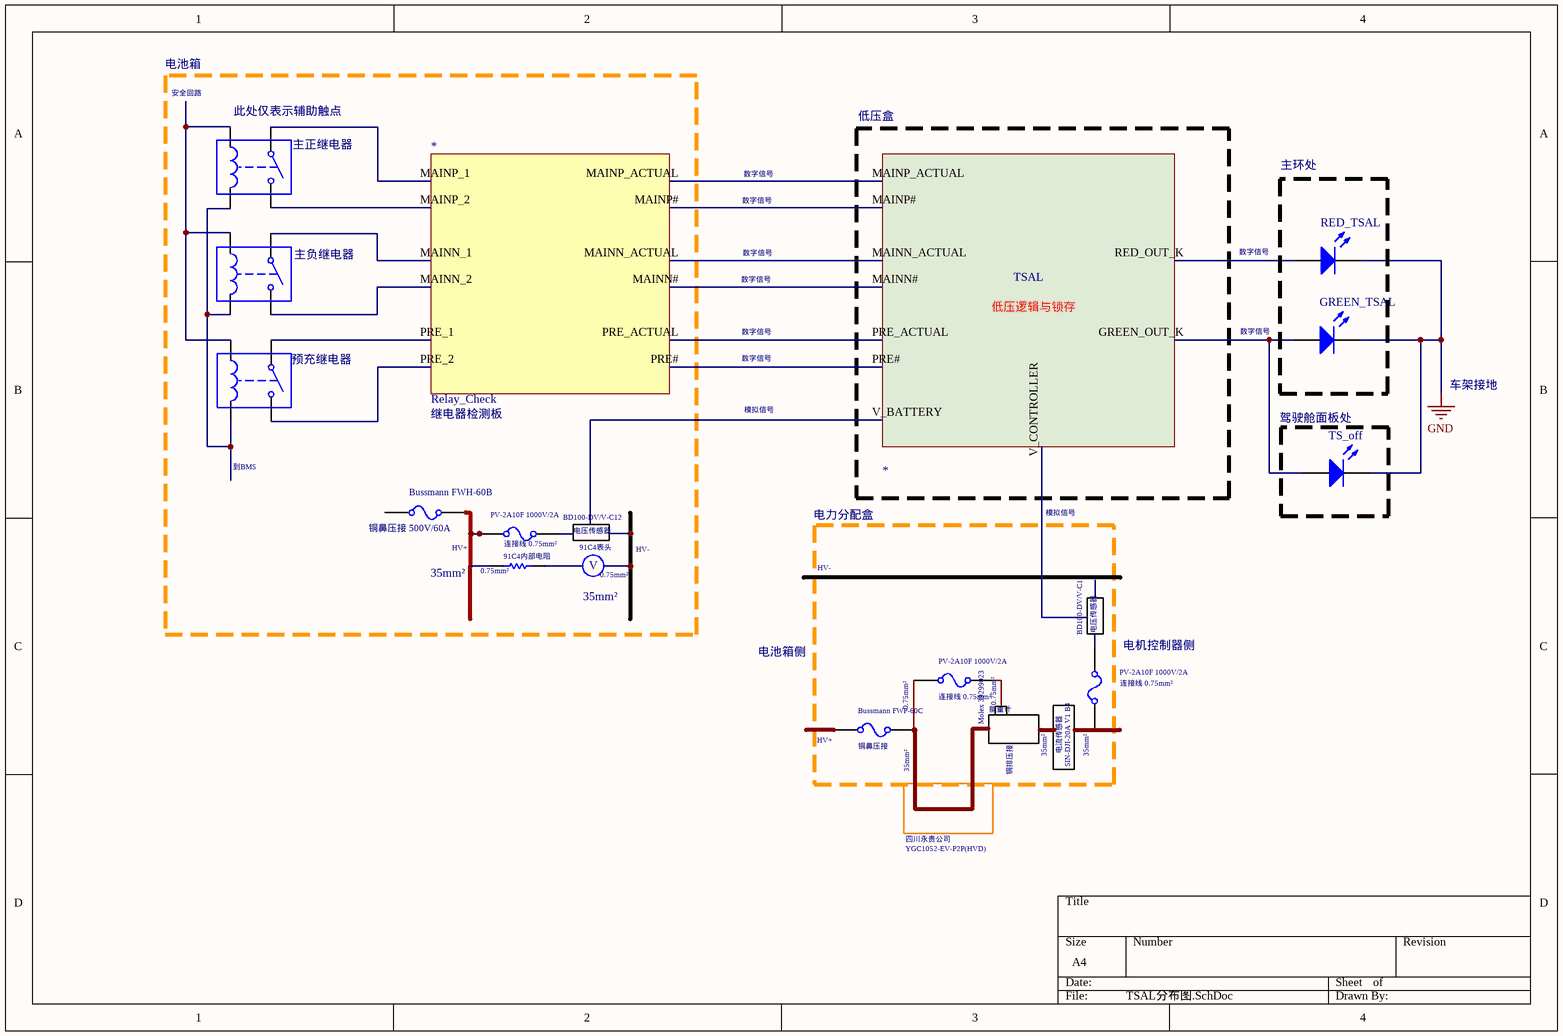
[diagram p8: TSAL分布图.SchDoc]

### Parts
(Parts that share a designator on the sheet are numbered #1, #2 ... from top to bottom, then left to right.)
91C4内部电阻#3  Resistor  (value not drawn)
*#15  Relay_Check
*#16  TSAL
Bussmann_FWH-60B#4  Fuse  (value not drawn)
Bussmann_FWP-60C#3  CURRENT: 铜鼻压接  (hidden comment: Fuse)
GREEN_TSAL  Light-Emitting Diode  (value not drawn)
PV-2A10F_1000V/2A#8  连接线 0.75mm²
PV-2A10F_1000V/2A#9  连接线 0.75mm²
PV-2A10F_1000V/2A#10  连接线 0.75mm²
RED_TSAL  Light-Emitting Diode  (value not drawn)
TS_off  Light-Emitting Diode  (value not drawn)
主正继电器#4  Single-Pole, Single-Throw Normally Opened Relay  (value not drawn)
主负继电器#4  Single-Pole, Single-Throw Normally Opened Relay  (value not drawn)
预充继电器#2  Single-Pole, Single-Throw Normally Opened Relay  (value not drawn)

### Blocks framed on the sheet
主环处: GREEN_TSAL RED_TSAL
驾驶舱面板处: TS_off
电力分配盒: Bussmann_FWP-60C#3 PV-2A10F_1000V/2A#9 PV-2A10F_1000V/2A#10

### Sub-sheets
电池箱 = YGC1052-EV-P2P(HVD) (file not in this document): no entries
电池箱 = 能量计 (file not in this document): no entries

### Nets
GND: GREEN_TSAL.2(K) RED_TSAL.2(K) TS_off.2(K)
Net91C4内部电阻#3_1: 91C4内部电阻#3.1 Bussmann_FWH-60B#4.1 PV-2A10F_1000V/2A#8.1
Net*#15_MAINN#: *#15.MAINN# *#16.MAINN#
Net*#15_MAINN_1: *#15.MAINN_1 主负继电器#4.1
Net*#15_MAINN_2: *#15.MAINN_2 主负继电器#4.2
Net*#15_MAINN_ACTUAL: *#15.MAINN_ACTUAL *#16.MAINN_ACTUAL
Net*#15_MAINP#: *#15.MAINP# *#16.MAINP#
Net*#15_MAINP_1: *#15.MAINP_1 主正继电器#4.1
Net*#15_MAINP_2: *#15.MAINP_2 主正继电器#4.2
Net*#15_MAINP_ACTUAL: *#15.MAINP_ACTUAL *#16.MAINP_ACTUAL
Net*#15_PRE#: *#15.PRE# *#16.PRE#
Net*#15_PRE_1: *#15.PRE_1 预充继电器#2.1
Net*#15_PRE_2: *#15.PRE_2 预充继电器#2.2
Net*#15_PRE_ACTUAL: *#15.PRE_ACTUAL *#16.PRE_ACTUAL
Net*#16_GREEN_OUT_K: *#16.GREEN_OUT_K GREEN_TSAL.1(A) TS_off.1(A)
Net*#16_RED_OUT_K: *#16.RED_OUT_K RED_TSAL.1(A)
NetBussmann_FWP-60C#3_2: Bussmann_FWP-60C#3.2 PV-2A10F_1000V/2A#9.2
Net主正继电器#4_3: 主正继电器#4.3 主负继电器#4.3 预充继电器#2.3
Net主正继电器#4_4: 主正继电器#4.4 主负继电器#4.4 预充继电器#2.4

Not connected (* = marked no-connect by the designer): 91C4内部电阻#3 2; *#16 V_BATTERY V_CONTROLLER; Bussmann_FWH-60B#4 2; Bussmann_FWP-60C#3 1; PV-2A10F_1000V/2A#8 2; PV-2A10F_1000V/2A#9 1; PV-2A10F_1000V/2A#10 1 2

### Notes on the sheet
- 电池箱
- 安全回路
- (near 主正继电器#4) 此处仅表示辅助触点
- 数字信号
- 低压盒
- (near *#16) 低压逻辑与锁存
- (near *#15) 继电器检测板
- 模拟信号
- 车架接地
- 到BMS
- (near PV-2A10F_1000V/2A#8) BD100-DV/V-C12
- (near *#16) 模拟信号
- (near Bussmann_FWH-60B#4) 铜鼻压接 500V/60A
- 35mm²
- HV+
- (near 91C4内部电阻#3) 0.75mm²
- 电压传感器
- 91C4表头
- V
- 0.75mm²
- HV-
- (near PV-2A10F_1000V/2A#10) BD100-DV/V-C12
- (near PV-2A10F_1000V/2A#10) 电压传感器
- (near PV-2A10F_1000V/2A#10) 电机控制器侧
- 电池箱侧
- (near PV-2A10F_1000V/2A#9) Molex 39299023
- (near PV-2A10F_1000V/2A#9) 0.75mm²
- (near Bussmann_FWP-60C#3) HV+
- (near Bussmann_FWP-60C#3) 35mm²
- 铜排压接
- (near PV-2A10F_1000V/2A#10) 电流传感器
- (near PV-2A10F_1000V/2A#10) SIN-DJI-20A V1 B4
- (near PV-2A10F_1000V/2A#10) 35mm²
- 四川永贵公司

### Library data of the parts
91C4内部电阻#3 = Resistor: as 91C4内部电阻#1 on sheet 电池箱内部原理图; TC2: 0
Bussmann_FWH-60B#4 PV-2A10F_1000V/2A#8-PV-2A10F_1000V/2A#10 = Fuse: as PV-2A10F on sheet 箱外驱动系统
Bussmann_FWP-60C#3 = Fuse: as Bussmann_FWP-60C#1 on sheet 箱外驱动系统
GREEN_TSAL RED_TSAL TS_off = LED: as D?#1 on sheet Bench; CJO: 0; CJP: 0; CTA: 0; CTP: 0; FCS: 0.5; FV_MAX: 1e99; IKF: 0; IKR: 0; ISR: 1e-14; JSW: 0; JTUN: 0; JTUNSW: 0; KEG: 1; KF: 0; LEVEL: 1; N: 1; NBV: 1; NR: 1; NS: 1; PHP: 1; RS: 0; TCV: 0; TLEV: 0; TLEVC: 0; TM1: 0; TM2: 0; TPB: 0; TPHP: 0; TRS: 0; TRS2: 0; TT: 0; TTT1: 0; TTT2: 0; VJ: 1; XTITUN: 3
主正继电器#4 主负继电器#4 预充继电器#2 = SPST Relay NO: as ASSI_B? on sheet Bench

## Sheet 电气拓扑.SchDoc
size 1270 x 1270 mm; SheetNumber: 1; SheetTotal: 2
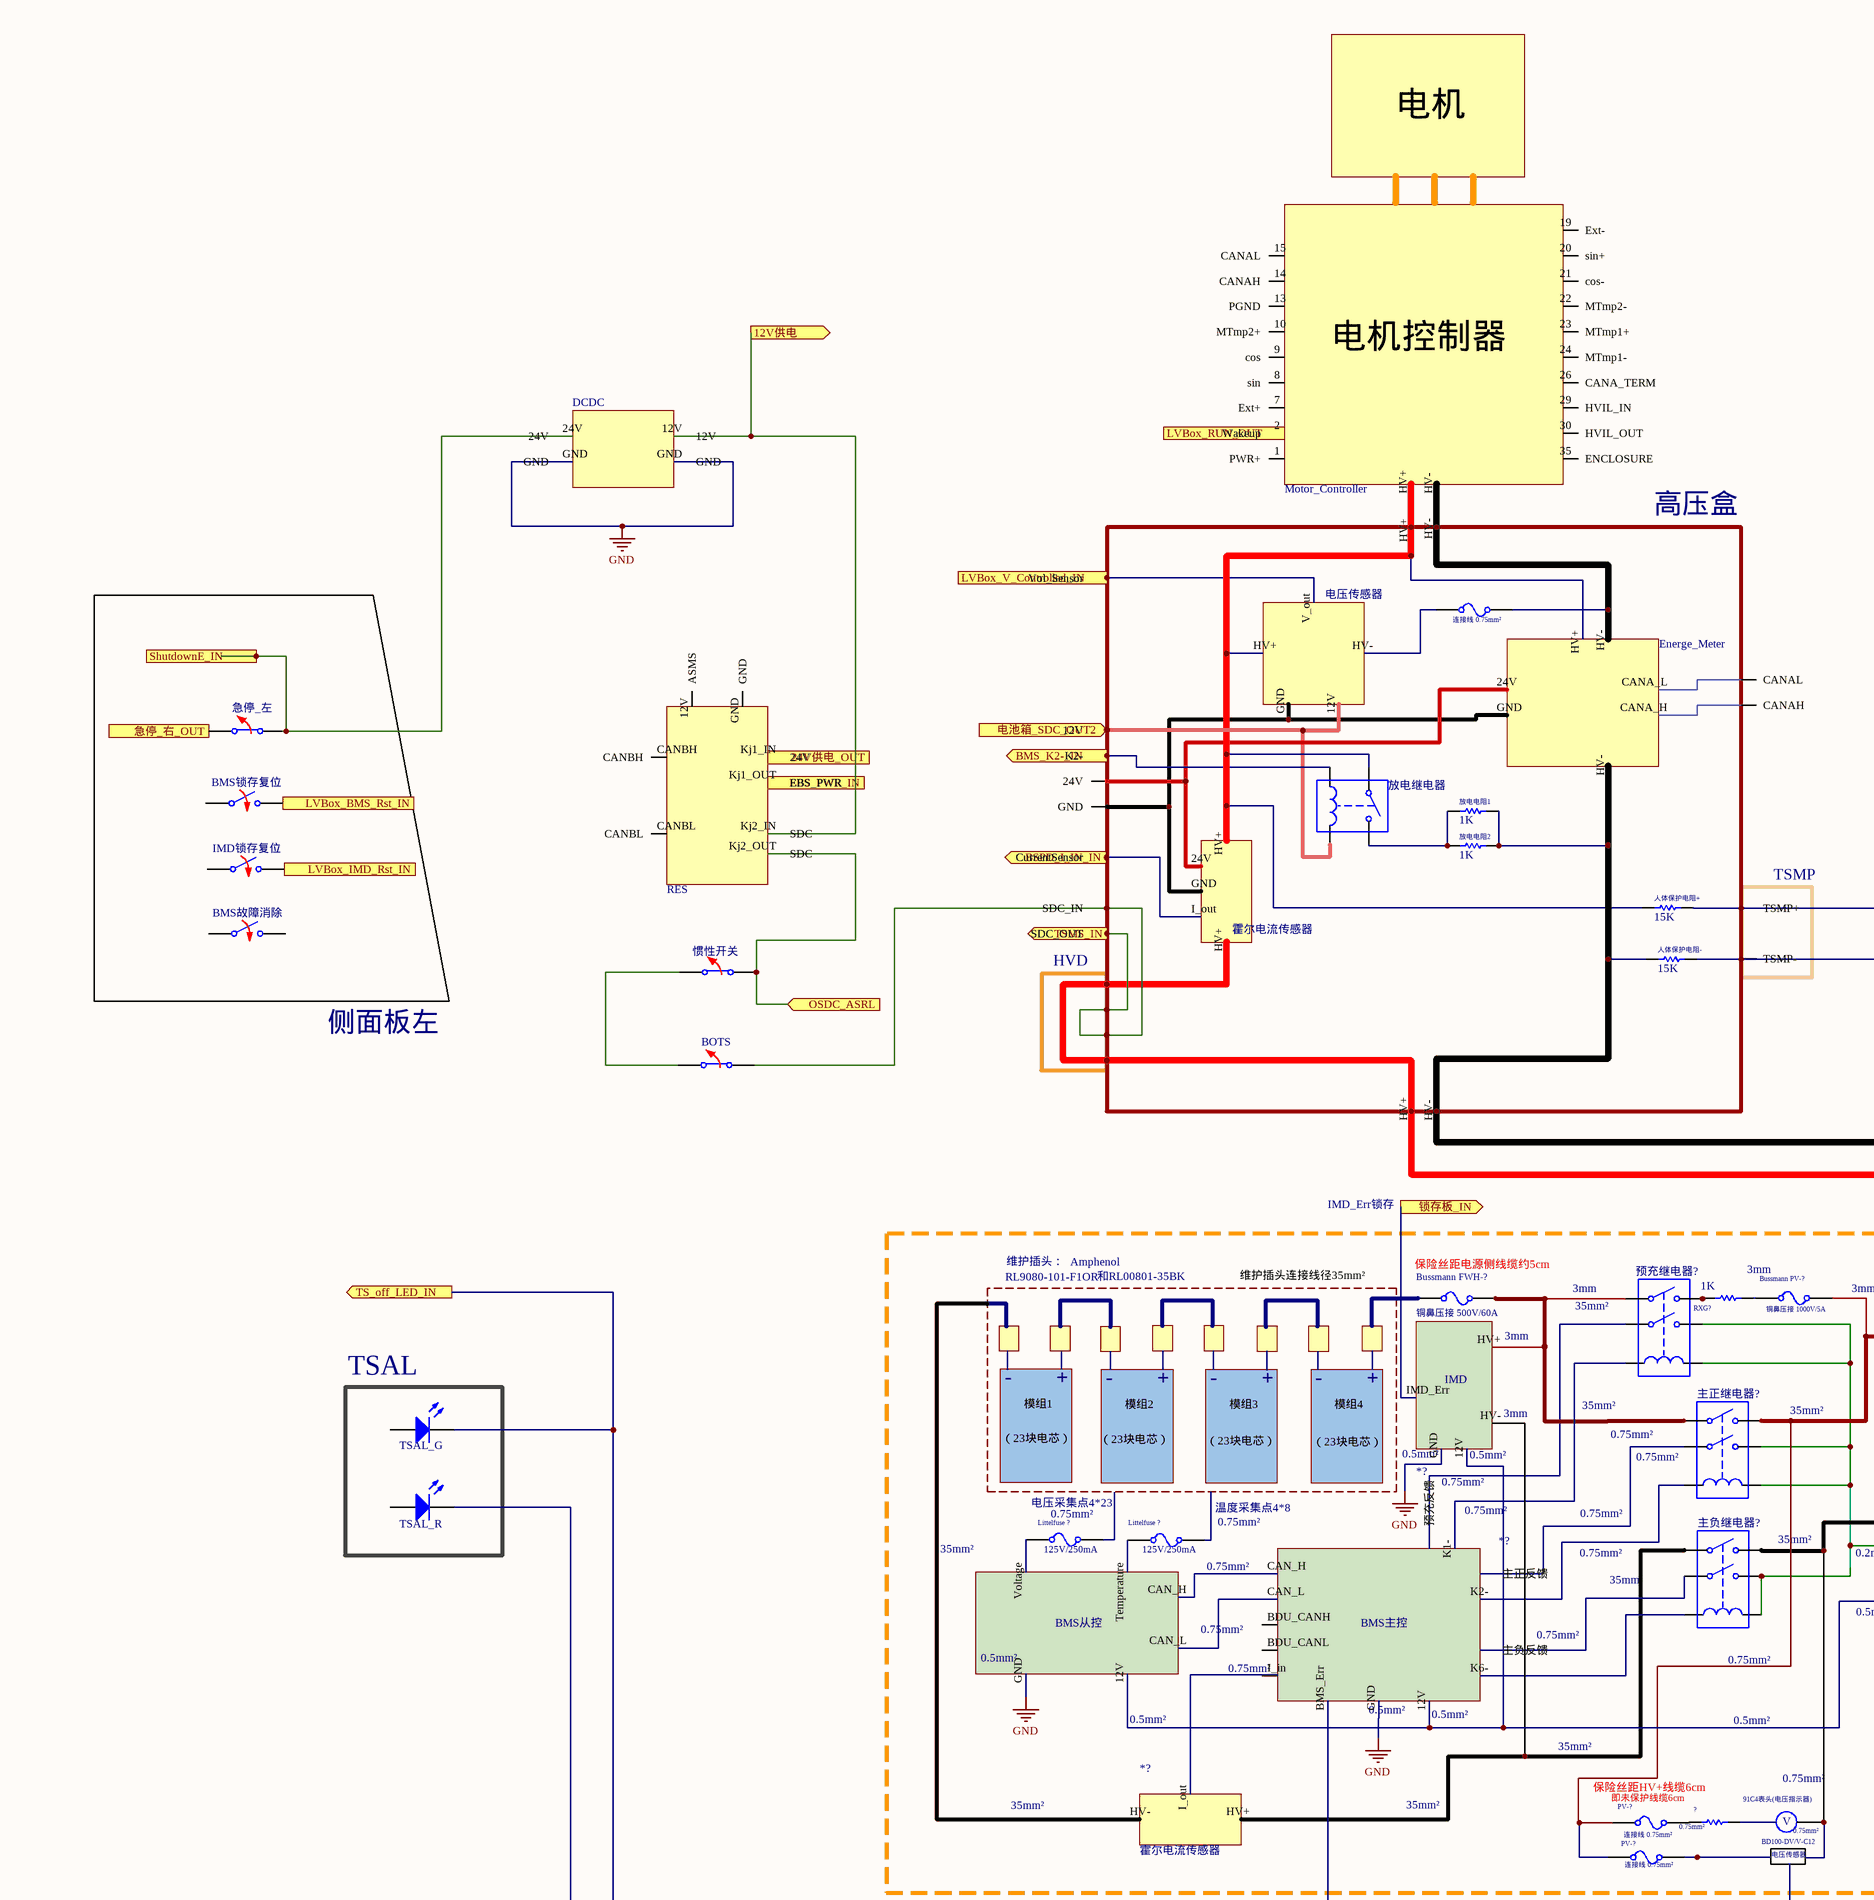
[diagram p9: 电气拓扑.SchDoc, top left]
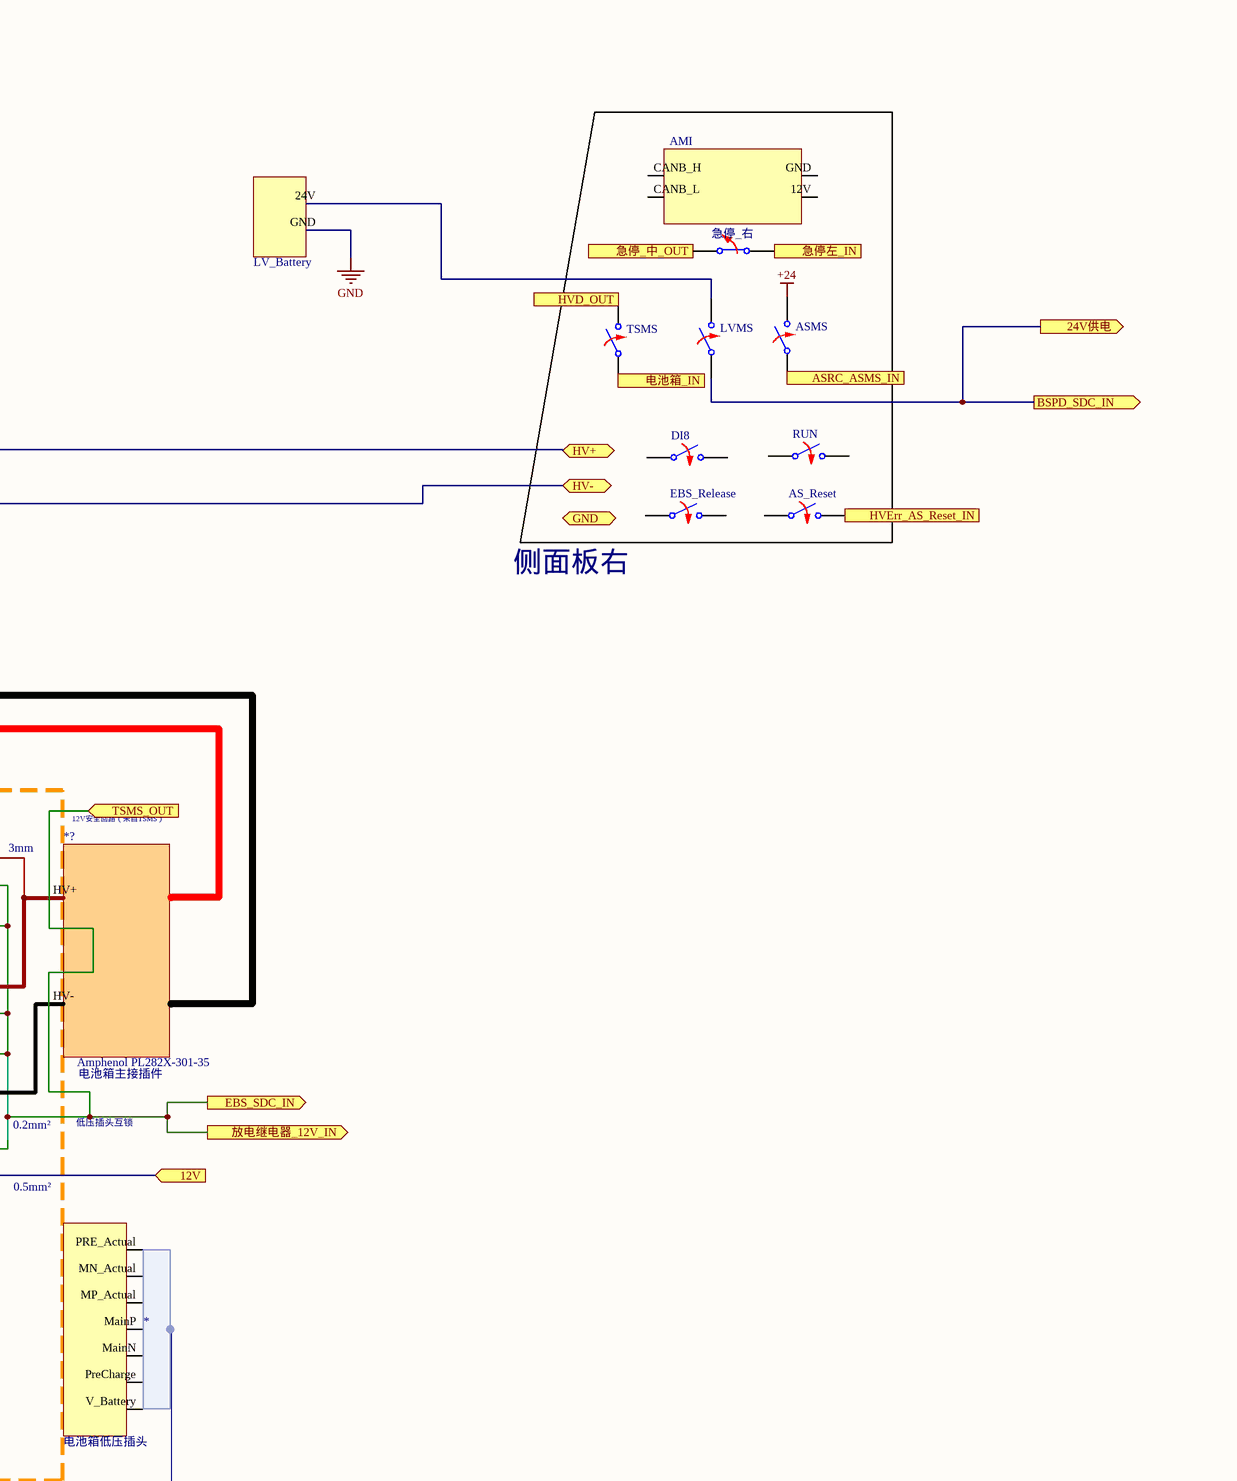
[diagram p10: 电气拓扑.SchDoc, top right]
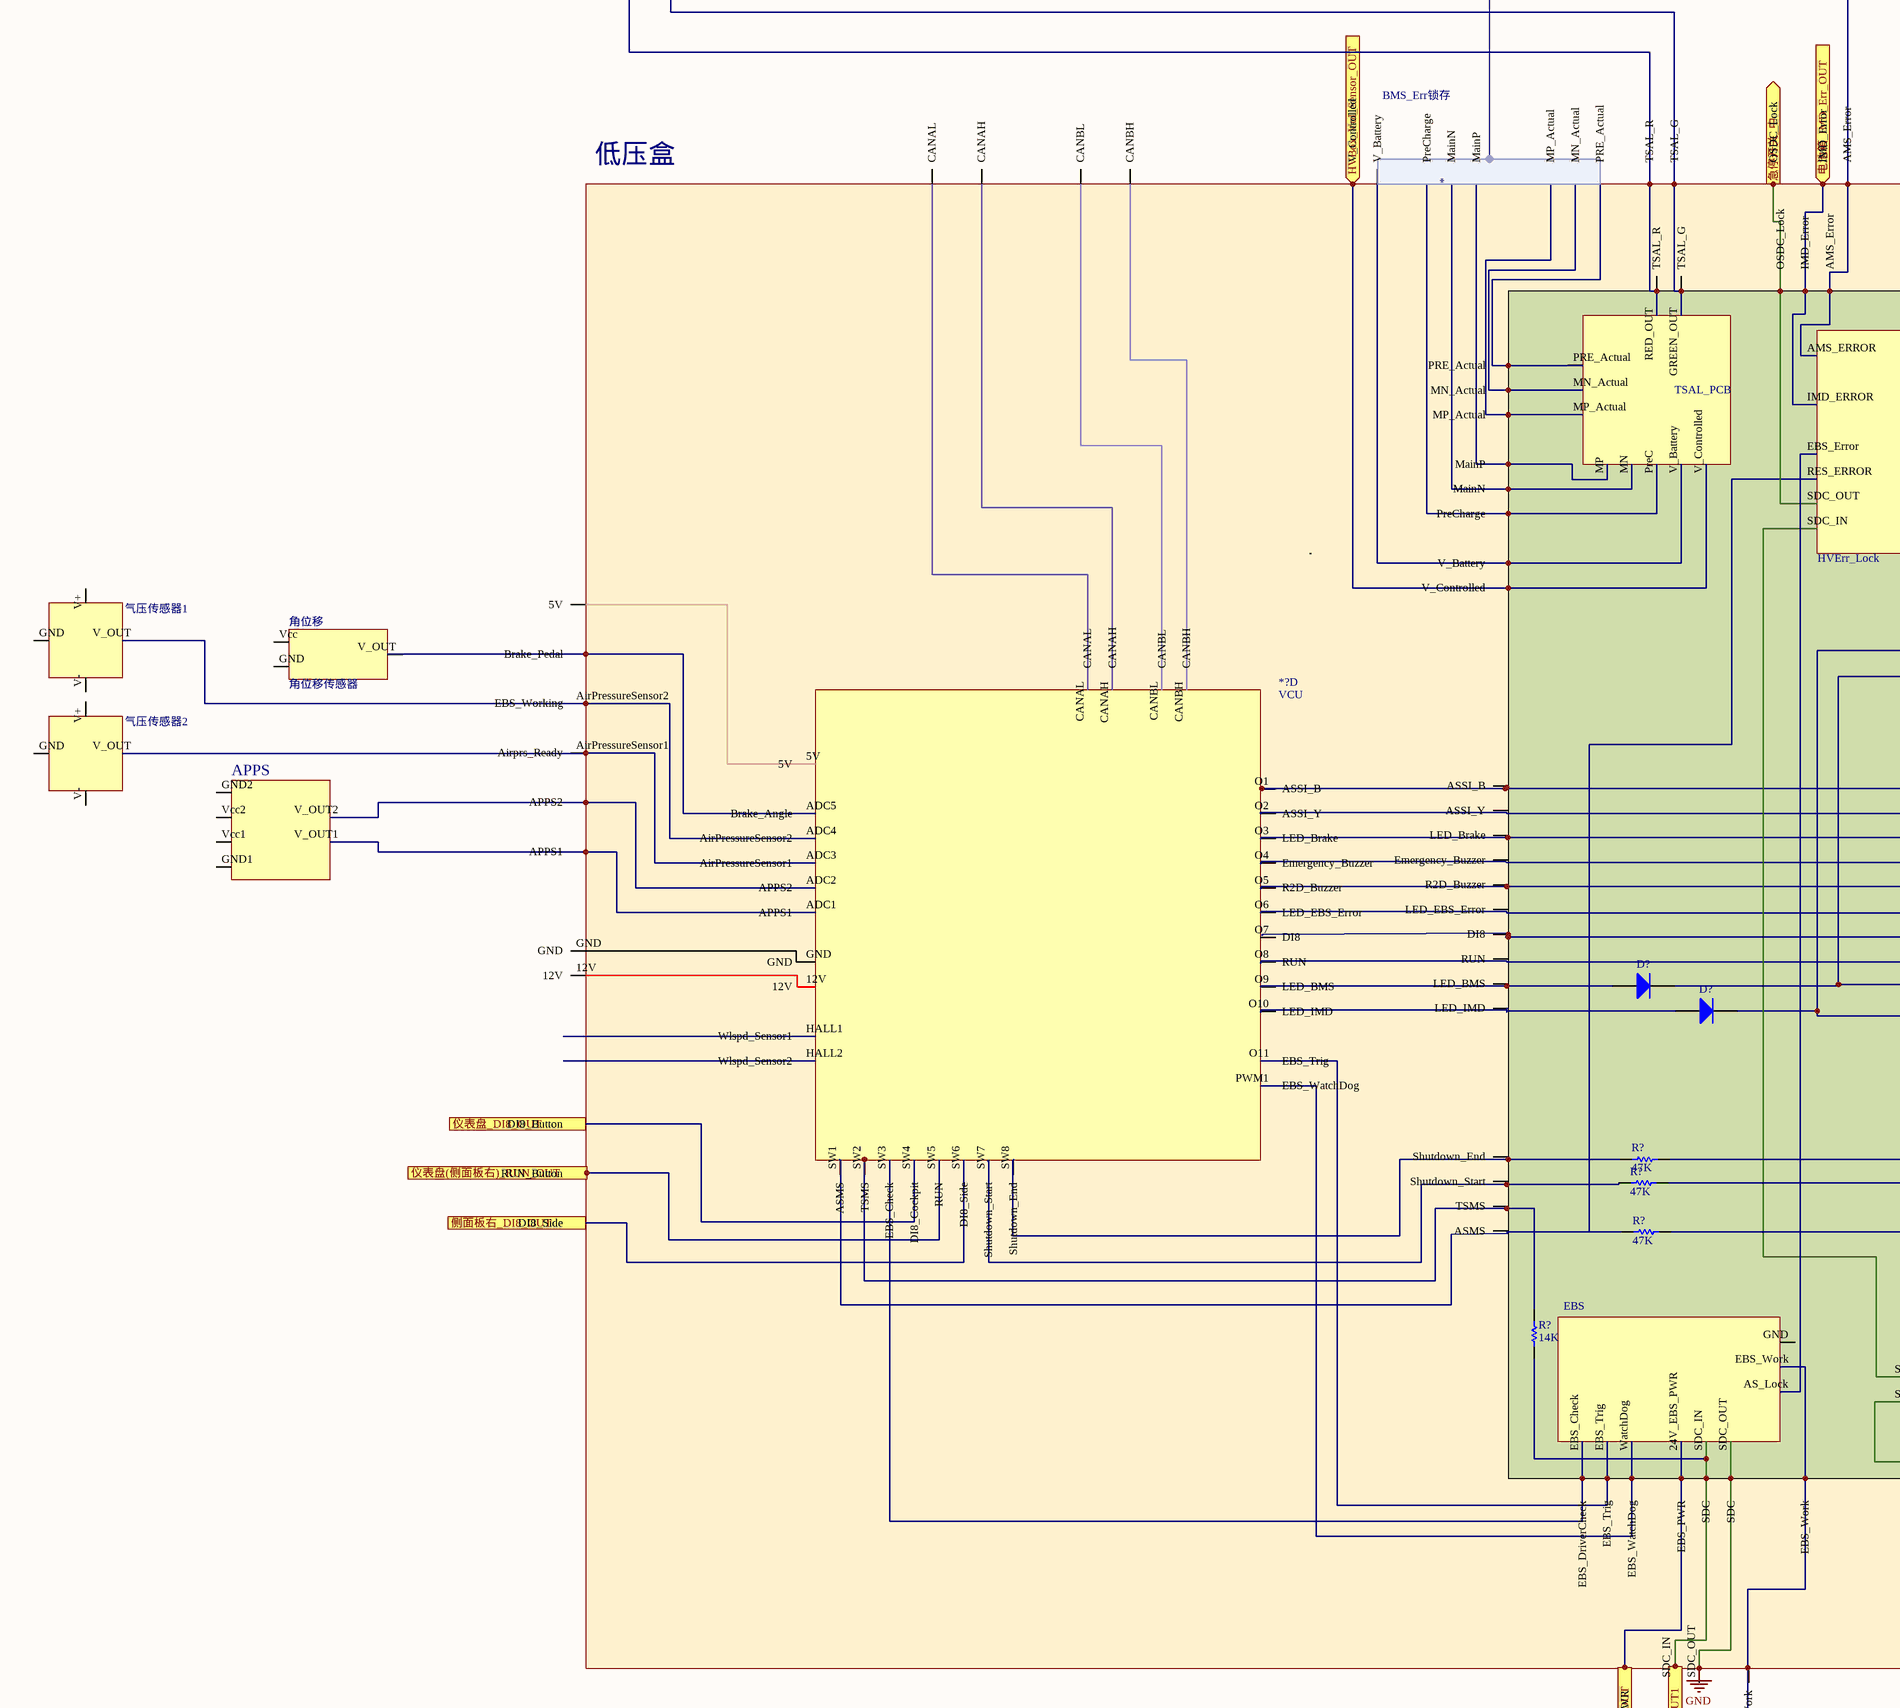
[diagram p11: 电气拓扑.SchDoc, centre left]
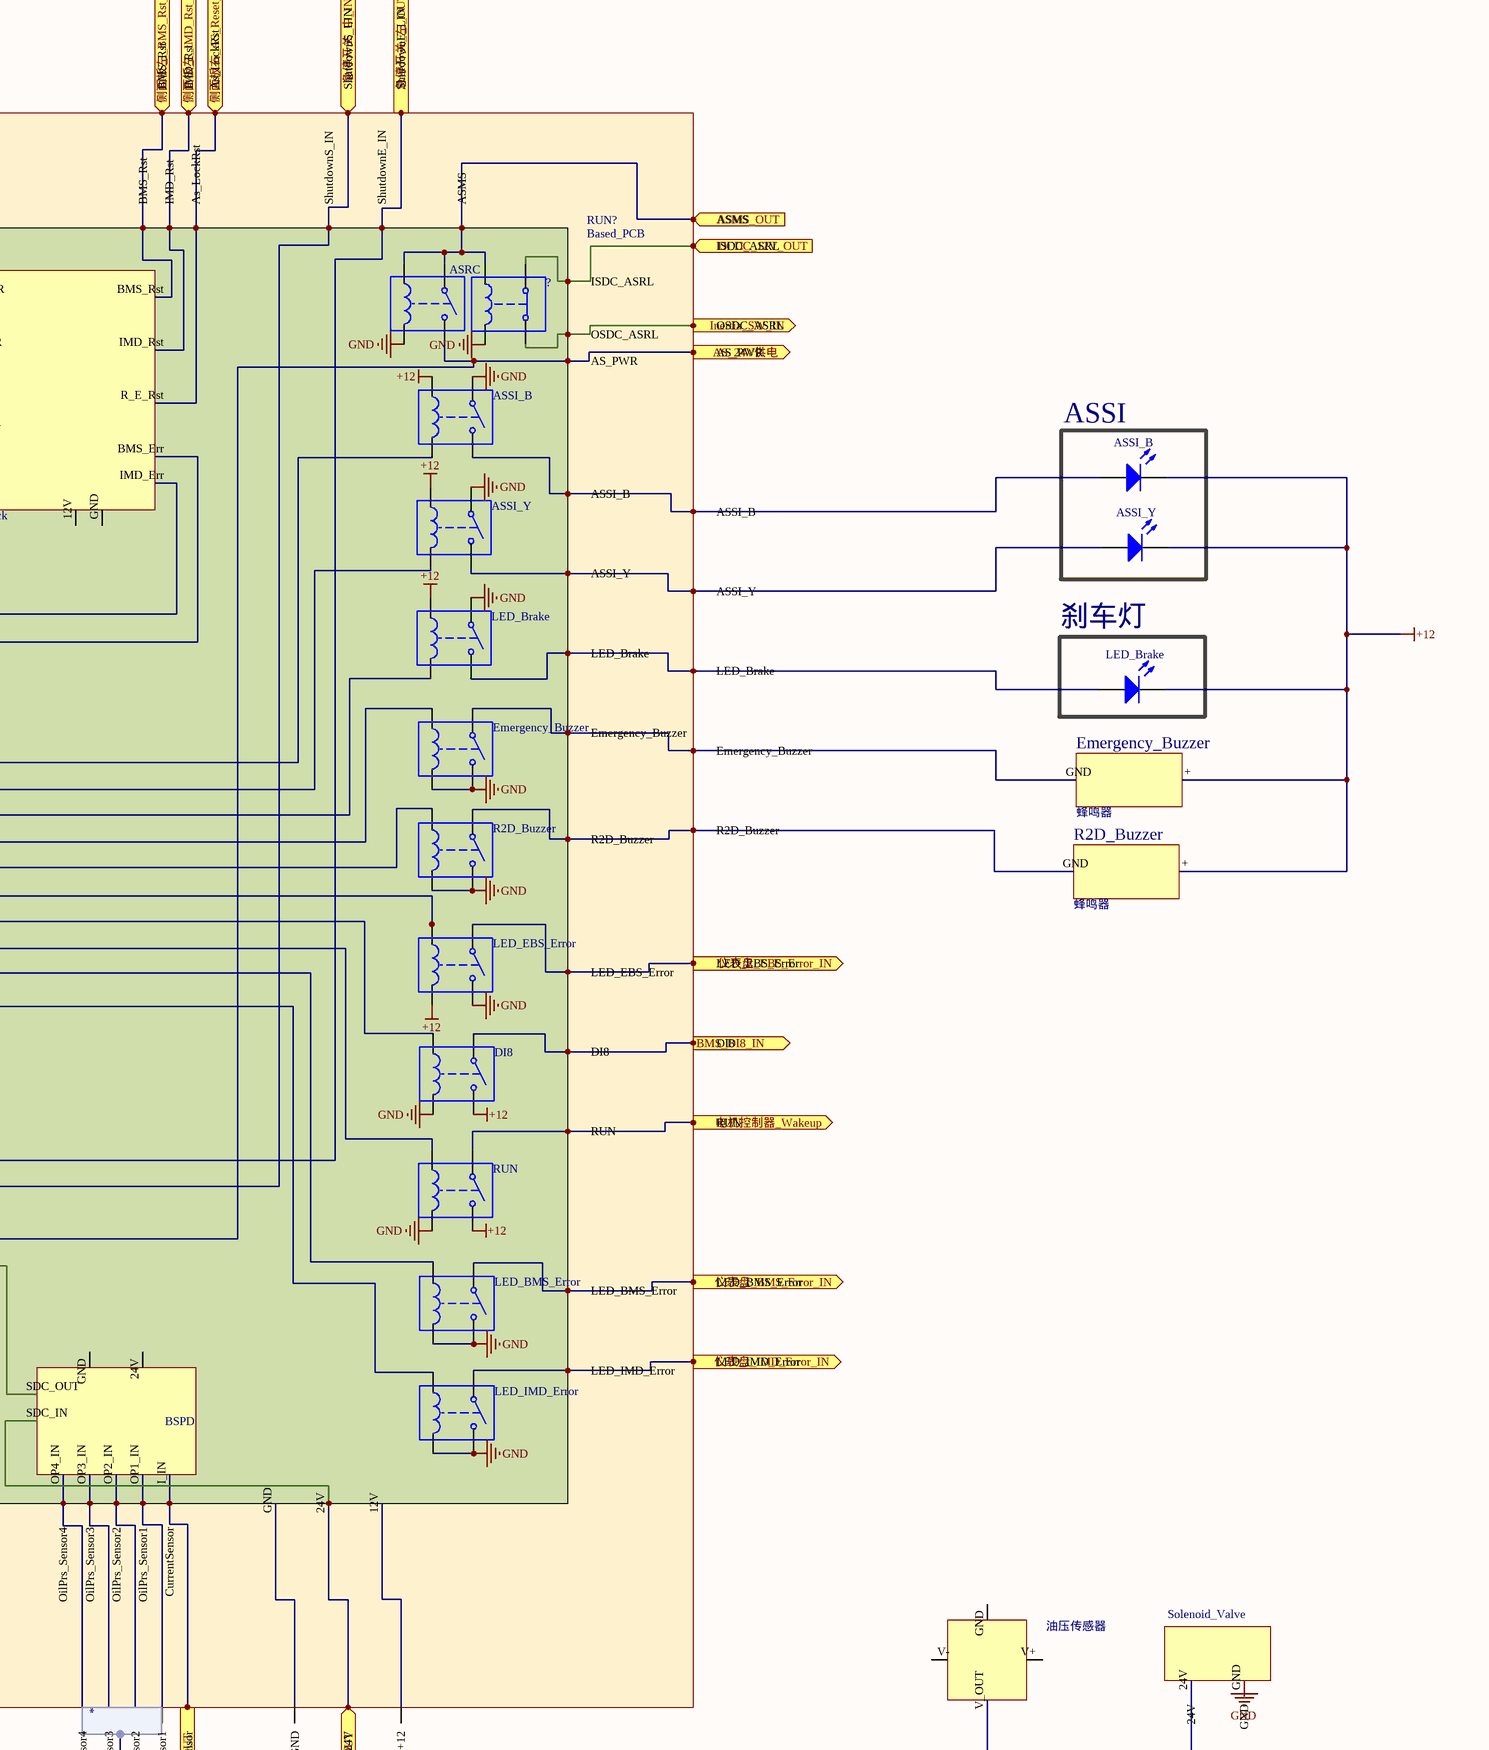
[diagram p12: 电气拓扑.SchDoc, centre right]
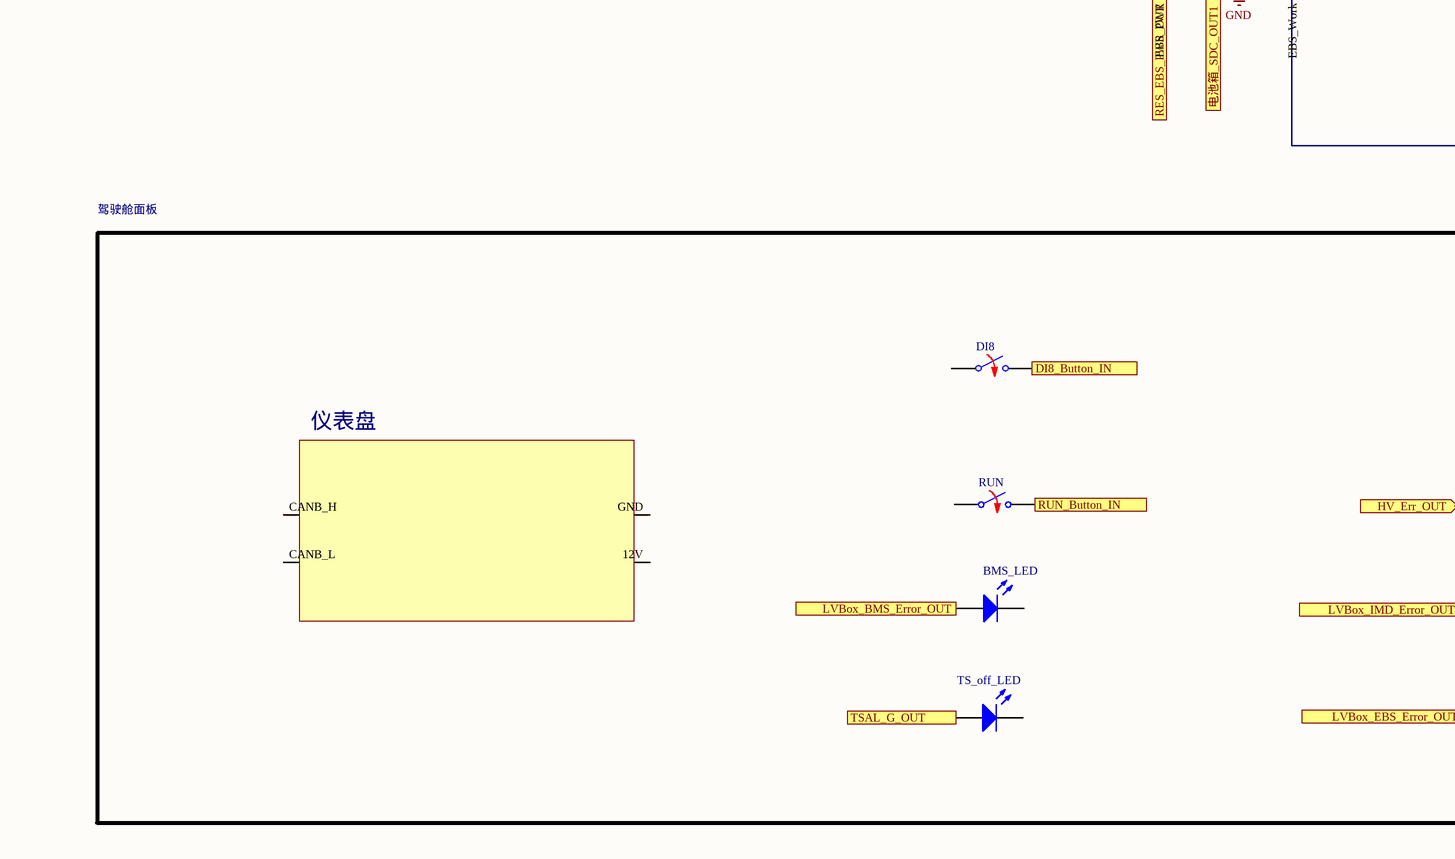
[diagram p13: 电气拓扑.SchDoc, bottom left]
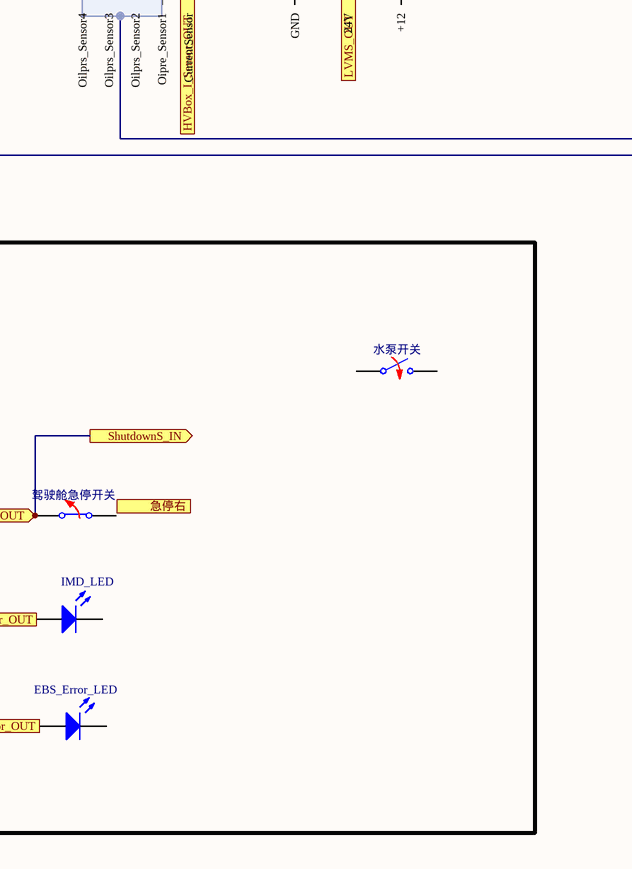
[diagram p14: 电气拓扑.SchDoc, bottom right]

### Parts
(Parts that share a designator on the sheet are numbered #1, #2 ... from top to bottom, then left to right.)
*#17  气压传感器2
*?#12  IMD
*?#13  Amphenol PL282X-301-35
*?#14  BMS从控
*?#15  BMS主控
*?#16  霍尔电流传感器
*?#17  VCU  (part D of 4)
?#2  侧面板右
?#3  Resistor  (value not drawn)
?#4  Single-Pole, Single-Throw Normally Closed Relay  (value not drawn)
?#5  HVErr_Lock
APPS  APPS  (value not drawn)
AS_Reset  Switch Normally Opened  (value not drawn)
ASMS#2  Switch Normally Opened  (value not drawn)
ASRC  Single-Pole, Single-Throw Normally Opened Relay  (value not drawn)
ASSI_B#1  Single-Pole, Single-Throw Normally Opened Relay  (value not drawn)
ASSI_B#2  Light-Emitting Diode  (value not drawn)
ASSI_Y#1  Single-Pole, Single-Throw Normally Opened Relay  (value not drawn)
ASSI_Y#2  Light-Emitting Diode  (value not drawn)
BMS_LED  Light-Emitting Diode  (value not drawn)
BMS故障消除  Switch Normally Opened  (value not drawn)
BMS锁存复位  Switch Normally Opened  (value not drawn)
BOTS#2  Switch Normally Closed  (value not drawn)
BSPD#2  BSPD  (value not drawn)
Bussmann_FWH-?  Fuse  (value not drawn)
Bussmann_PV-?  Fuse  (value not drawn)
D?#18  Diode  (value not drawn)
D?#19  Diode  (value not drawn)
DCDC  DCDC
DI8#1  Switch Normally Opened  (value not drawn)
DI8#2  Single-Pole, Single-Throw Normally Opened Relay  (value not drawn)
DI8#3  Switch Normally Opened  (value not drawn)
EBS  EBS_Driver  (value not drawn)
EBS_Error_LED  Light-Emitting Diode  (value not drawn)
EBS_Release  Switch Normally Opened  (value not drawn)
Emergency_Buzzer#1  Single-Pole, Single-Throw Normally Opened Relay  (value not drawn)
Emergency_Buzzer#2  蜂鸣器
HV_Box  高压盒
HVBox_BMS_Error_OUT  驾驶舱面板
IMD_LED  Light-Emitting Diode  (value not drawn)
IMD锁存复位  Switch Normally Opened  (value not drawn)
LED_BMS_Error  Single-Pole, Single-Throw Normally Opened Relay  (value not drawn)
LED_Brake#1  Single-Pole, Single-Throw Normally Opened Relay  (value not drawn)
LED_Brake#2  Light-Emitting Diode  (value not drawn)
LED_EBS_Error  Single-Pole, Single-Throw Normally Opened Relay  (value not drawn)
LED_IMD_Error  Single-Pole, Single-Throw Normally Opened Relay  (value not drawn)
Littelfuse_?#1  CURRENT: 125V/250mA  (hidden comment: Fuse)
Littelfuse_?#2  CURRENT: 125V/250mA  (hidden comment: Fuse)
LVMS#2  Switch Normally Opened  (value not drawn)
PV  连接线 0.75mm²
PV-?#1  连接线 0.75mm²
PV-?#2  连接线 0.75mm²
R2D_Buzzer#1  Single-Pole, Single-Throw Normally Opened Relay  (value not drawn)
R2D_Buzzer#2  蜂鸣器
R?#12  value 47K  (hidden comment: Resistor)
R?#13  value 47K  (hidden comment: Resistor)
R?#14  value 47K  (hidden comment: Resistor)
R?#15  value 14K  (hidden comment: Resistor)
RES#2  RES
RUN#1  Switch Normally Opened  (value not drawn)
RUN#2  Single-Pole, Single-Throw Normally Opened Relay  (value not drawn)
RUN#3  Switch Normally Opened  (value not drawn)
RUN?#3  Based_PCB
RXG?  value 1K  (hidden comment: Resistor)
TS_off_LED  Light-Emitting Diode  (value not drawn)
TSAL_G  Light-Emitting Diode  (value not drawn)
TSAL_PCB  TSAL_PCB  (value not drawn)
TSAL_R  Light-Emitting Diode  (value not drawn)
TSMS#2  Switch Normally Opened  (value not drawn)
主正继电器?#2  Double-Pole, Single-Throw Relay  (value not drawn)
主负继电器?#2  Double-Pole, Single-Throw Relay  (value not drawn)
人体保护电阻+  value 15K  (hidden comment: Resistor)
人体保护电阻-  value 15K  (hidden comment: Resistor)
低压电池  LV_Battery
低压盒  LV_Box  (value not drawn)
侧面板左  侧面板左
急停_右  Switch Normally Closed  (value not drawn)
急停_左  Switch Normally Closed  (value not drawn)
惯性开关  Switch Normally Closed  (value not drawn)
放电电阻1  value 1K  (hidden comment: Resistor)
放电电阻2  value 1K  (hidden comment: Resistor)
放电继电器#2  Single-Pole, Single-Throw Normally Opened Relay  (value not drawn)
气压传感器1  (no value)
水泵开关  Switch Normally Opened  (value not drawn)
油压传感器  油压传感器
电压传感器  电压传感器
电机控制器  Motor_Controller
电池箱低压插头  电池箱低压插头
电流传感器  霍尔电流传感器
电磁阀  Solenoid_Valve
能量计  Energe_Meter
角位移  角位移传感器
预充继电器?#2  Double-Pole, Single-Throw Relay  (value not drawn)
驾驶舱急停开关  Switch Normally Closed  (value not drawn)

### Blocks framed on the sheet
TSAL: TSAL_G TSAL_R
ASSI: ASSI_B#2 ASSI_Y#2
刹车灯: LED_Brake#2

### Ports
12V (in), 12V供电 (out), 24V供电 (out), 24V供电_OUT (in), AS_24V供电 (out), ASMS_OUT (in), ASRC_ASMS_IN (out), BMS_DI8_IN (out), BMS_K2-_IN (out), BSPD_I_IN_IN (out), BSPD_SDC_IN (out), DCDC_12V_OUT (in), DI8_Button_IN (out), EBS_PWR_IN (out), EBS_SDC_IN (out), GND (bidir), HV+ (bidir), HV- (bidir), HV_Err_OUT (in), HVBox_I_Sensor_OUT (in), HVBox_Vol_Sensor_OUT (in), HVD_OUT (in), HVErr_AS_Reset_IN (out), Inertia_SW_IN (out), LVBox_BMS_Error_OUT (in), LVBox_BMS_Rst_IN (out), LVBox_EBS_Error_OUT (in), LVBox_IMD_Error_OUT, LVBox_IMD_Rst_IN (out), LVBox_RUN_OUT, LVBox_V_Controlled_IN (out), LVMS_OUT (in), OSDC_ASRL (in), RES_EBS_PWR_OUT (in), RUN_Button_IN (out), ShutdownE_IN (in), ShutdownS_IN (out), TS_off_LED_IN (out), TSAL_G_OUT (in), TSMS_IN (out), TSMS_OUT (in), 仪表盘(侧面板右)_RUN_OUT (in), 仪表盘_BMS_Error_IN (out), 仪表盘_DI8_OUT (in), 仪表盘_EBS_Error_IN (out), 仪表盘_IMD_Error_IN (out), 侧面板右_AS_Reset_OUT (in), 侧面板右_DI8_OUT, 侧面板左_BMS_Rst_OUT (in), 侧面板左_IMD_Rst_OUT (in), 急停_中_OUT (in), 急停_右_OUT (in), 急停右 (out), 急停左_IN (out), 急停开关_中 (out), 急停开关_中_IN (in), 急停开关_左_OUT (out), 放电继电器_12V_IN (out), 电机控制器_Wakeup (out), 电池箱_IMD_Err_OUT (in), 电池箱_IN (out), 电池箱_SDC_OUT1 (in), 电池箱_SDC_OUT2 (in), 锁存板_IN (out)

### Harnesses
*: 

### Nets
+12: ASSI_B#1.3 ASSI_B#2.2(K) ASSI_Y#1.3 ASSI_Y#2.2(K) DI8#2.2 Emergency_Buzzer#2.+ LED_Brake#1.3 LED_Brake#2.2(K) LED_EBS_Error.4 R2D_Buzzer#2.+ RUN#2.2
+24: ASMS#2.2
GND: *?#12.GND *?#14.GND *?#15.GND ?#4.4 ASRC.4 ASSI_B#1.1 ASSI_Y#1.1 DCDC.GND DI8#2.4 EBS.SDC_OUT Emergency_Buzzer#1.2 Emergency_Buzzer#1.4 LED_BMS_Error.2 LED_BMS_Error.4 LED_Brake#1.1 LED_EBS_Error.2 LED_IMD_Error.2 LED_IMD_Error.4 R2D_Buzzer#1.2 R2D_Buzzer#1.4 RUN#2.4 RUN?#3.?2(SDC) 低压电池.GND 低压盒.SDC_OUT 电磁阀.GND
Net*#17_V_OUT: *#17.V_OUT *?#17.ADC3(AirPressureSensor1) 低压盒.AirPressureSensor1(Airprs_Ready)
Net*?#12_12V: *?#12.12V *?#14.12V *?#15.12V ; port 12V
Net*?#12_HV+: *?#12.HV+ Bussmann_FWH-?.2 主正继电器?#2.1 预充继电器?#2.1
Net*?#12_HV-: *?#12.HV- *?#16.HV+ 主负继电器?#2.1
Net*?#12_IMD_Err: *?#12.IMD_Err ; port 锁存板_IN
Net*?#13_HV+: *?#13.HV+ Bussmann_PV-?.2 PV-?#1.1 PV-?#2.1 主正继电器?#2.2
Net*?#13_HV-: *?#13.HV- 主负继电器?#2.2
Net*?#14_CAN_H: *?#14.CAN_H *?#15.CAN_H
Net*?#14_CAN_L: *?#14.CAN_L *?#15.CAN_L
Net*?#14_Temperature: *?#14.Temperature Littelfuse_?#2.1
Net*?#14_Voltage: *?#14.Voltage Littelfuse_?#1.1
Net*?#15_?1: *?#15.?1(主负反馈) 主负继电器?#2.3
Net*?#15_?2: *?#15.?2(主正反馈) 主正继电器?#2.3
Net*?#15_?3: *?#15.?3(预充反馈) 预充继电器?#2.3
Net*?#15_BMS_Err: *?#15.BMS_Err ?#5.AMS_ERROR RUN?#3.?28(AMS_Error) 低压盒.?20(AMS_Error)
Net*?#15_I_in: *?#15.I_in *?#16.I_out
Net*?#15_K1-: *?#15.K1- 预充继电器?#2.5
Net*?#15_K2-: *?#15.K2- 主正继电器?#2.5
Net*?#15_K6-: *?#15.K6- 主负继电器?#2.5
Net*?#17_5V: *?#17.5V 低压盒.?41(5V)
Net*?#17_12V: *?#17.12V 低压盒.12V
Net*?#17_ADC1: *?#17.ADC1(APPS1) APPS.V_OUT1 低压盒.?3(APPS1)
Net*?#17_ADC2: *?#17.ADC2(APPS2) APPS.V_OUT2 低压盒.?2(APPS2)
Net*?#17_ADC4: *?#17.ADC4(AirPressureSensor2) 低压盒.AirPressureSensor2(EBS_Working) 气压传感器1.V_OUT
Net*?#17_ADC5: *?#17.ADC5(Brake_Angle) 低压盒.?1(Brake_Pedal) 角位移.V_OUT
Net*?#17_CANAH: *?#17.CANAH 低压盒.?7(CANAH)
Net*?#17_CANAL: *?#17.CANAL 低压盒.?6(CANAL)
Net*?#17_CANBH: *?#17.CANBH 低压盒.?9(CANBH)
Net*?#17_CANBL: *?#17.CANBL 低压盒.?8(CANBL)
Net*?#17_GND: *?#17.GND 低压盒.GND
Net*?#17_O1: *?#17.O1(ASSI_B) ASSI_B#1.4 RUN?#3.?17(ASSI_B)
Net*?#17_O2: *?#17.O2(ASSI_Y) ASSI_Y#1.4
Net*?#17_O3: *?#17.O3(LED_Brake) LED_Brake#1.4
Net*?#17_O4: *?#17.O4(Emergency_Buzzer) Emergency_Buzzer#1.3
Net*?#17_O5: *?#17.O5(R2D_Buzzer) R2D_Buzzer#1.3
Net*?#17_O6: *?#17.O6(LED_EBS_Error) LED_EBS_Error.3
Net*?#17_O8: *?#17.O8(RUN) RUN#2.3
Net*?#17_O9: *?#17.O9(LED_BMS) D?#18.1(A)
Net*?#17_O10: *?#17.O10(LED_IMD) D?#19.1(A) RUN?#3.?56(LED_IMD)
Net*?#17_O11: *?#17.O11(EBS_Trig) EBS.EBS_Trig RUN?#3.?4(EBS_Trig)
Net*?#17_PWM1: *?#17.PWM1(EBS_WatchDog) EBS.WatchDog RUN?#3.?5(EBS_WatchDog)
Net*?#17_SW1: *?#17.SW1(ASMS) ?#5.RES_ERROR R?#14.1
Net*?#17_SW2: *?#17.SW2(TSMS) R?#15.2
Net*?#17_SW3: *?#17.SW3(EBS_Check) EBS.EBS_Check RUN?#3.?3(EBS_DriverCheck)
Net*?#17_SW4: *?#17.SW4(DI8_Cockpit) 低压盒.?4(DI8_Button) ; port 仪表盘_DI8_OUT
Net*?#17_SW5: *?#17.SW5(RUN) 低压盒.?5(RUN_Button) ; port 仪表盘(侧面板右)_RUN_OUT
Net*?#17_SW6: *?#17.SW6(DI8_Side) 低压盒.?43(DI8_Side) ; port 侧面板右_DI8_OUT
Net*?#17_SW8: *?#17.SW8(Shutdown_End) R?#12.1 RUN?#3.?52(Shutdown_End)
Net?#4_1: ?#4.1 RUN?#3.?34(ISDC_ASRL) 低压盒.?25(ISDC_ASRL) ; port DCDC_12V_OUT
Net?#4_2: ?#4.2 RUN?#3.?35(OSDC_ASRL) 低压盒.?26(OSDC_ASRL) ; port Inertia_SW_IN
Net?#4_3: ?#4.3 ASRC.1 ASRC.3 RUN?#3.?32(ASMS) 低压盒.?24(ASMS) ; port ASMS_OUT
Net?#5_BMS_Err: ?#5.BMS_Err D?#18.2(K) LED_BMS_Error.3
Net?#5_BMS_Rst: ?#5.BMS_Rst RUN?#3.?31(BMS_Rst) 低压盒.?23(BMS_Rst) ; port 侧面板左_BMS_Rst_OUT
Net?#5_EBS_Error: ?#5.EBS_Error EBS.AS_Lock(WatchDog)
Net?#5_IMD_Err: ?#5.IMD_Err D?#19.2(K) LED_IMD_Error.3
Net?#5_IMD_ERROR: ?#5.IMD_ERROR RUN?#3.?27(IMD_Error) 低压盒.?21(IMD_Error) ; port 电池箱_IMD_Err_OUT
Net?#5_IMD_Rst: ?#5.IMD_Rst RUN?#3.?30(IMD_Rst) 低压盒.?42(IMD_Rst) ; port 侧面板左_IMD_Rst_OUT
Net?#5_R_E_Rst: ?#5.R_E_Rst RUN?#3.?57(As_LockRst) 低压盒.?22(As_LockRst) ; port 侧面板右_AS_Reset_OUT
Net?#5_SDC_IN: ?#5.SDC_IN BSPD#2.SDC_OUT
Net?#5_SDC_OUT: ?#5.SDC_OUT RUN?#3.?29(OSDC_Lock) 低压盒.?19(OSDC_Lock) ; port 急停开关_中
NetAS_Reset_2: AS_Reset.2 ; port HVErr_AS_Reset_IN
NetASMS#2_1: ASMS#2.1 ; port ASRC_ASMS_IN
NetASRC_2: ASRC.2 R?#14.2 RUN?#3.?33(AS_PWR) 低压盒.?27(AS_PWR) ; port AS_24V供电
NetASSI_B#1_2: ASSI_B#1.2 ASSI_B#2.1(A) RUN?#3.?36(ASSI_B) 低压盒.?28(ASSI_B)
NetASSI_Y#1_2: ASSI_Y#1.2 ASSI_Y#2.1(A) RUN?#3.?37(ASSI_Y) 低压盒.?29(ASSI_Y)
NetBMS锁存复位_2: BMS锁存复位.2 ; port LVBox_BMS_Rst_IN
NetBOTS#2_1: BOTS#2.1 惯性开关.1
NetBOTS#2_2: BOTS#2.2 HV_Box.HVD+ HV_Box.HVD- HV_Box.SDCIL_I(SDC_IN) HV_Box.SDCIL_O(SDC_OUT) ; port TSMS_IN
NetBSPD#2_I_IN: BSPD#2.I_IN RUN?#3.?7(CurrentSensor) 低压盒.?40(CurrentSensor) ; port HVBox_I_Sensor_OUT
NetBSPD#2_OP1_IN: BSPD#2.OP1_IN RUN?#3.?8(OilPrs_Sensor1) 低压盒.?39(Oipre_Sensor1)
NetBSPD#2_OP2_IN: BSPD#2.OP2_IN RUN?#3.?9(OilPrs_Sensor2) 低压盒.?44(Oilprs_Sensor2)
NetBSPD#2_OP3_IN: BSPD#2.OP3_IN RUN?#3.?47(OilPrs_Sensor3) 低压盒.?38(Oilprs_Sensor3)
NetBSPD#2_OP4_IN: BSPD#2.OP4_IN RUN?#3.?48(OilPrs_Sensor4) 低压盒.?45(Oilprs_Sensor4)
NetBSPD#2_SDC_IN: BSPD#2.SDC_IN RUN?#3.24V 低压盒.24V ; port LVMS_OUT
NetBussmann_PV-?_1: Bussmann_PV-?.1 RXG?.2
NetDCDC_12V: DCDC.12V RES#2.Kj2_IN(SDC) ; port 12V供电
NetDCDC_24V: DCDC.24V 急停_左.2 ; port ShutdownE_IN
NetDI8#2_1: DI8#2.1 RUN?#3.?42(DI8) 低压盒.?34(DI8) ; port BMS_DI8_IN
NetDI8#2_3: DI8#2.3 RUN?#3.?23(DI8)
NetDI8#3_2: DI8#3.2 ; port DI8_Button_IN
NetEBS_24V_EBS_PWR: EBS.24V_EBS_PWR RUN?#3.?44(EBS_PWR) 低压盒.?36(EBS_PWR) ; port RES_EBS_PWR_OUT
NetEBS_EBS_Work: EBS.EBS_Work RUN?#3.?6(EBS_Work) 低压盒.?37(EBS_Work) 电磁阀.24V
NetEBS_Error_LED_1: EBS_Error_LED.1(A) ; port LVBox_EBS_Error_OUT
NetEBS_SDC_IN: EBS.SDC_IN R?#15.1 RUN?#3.?1(SDC) 低压盒.SDC_IN ; port 电池箱_SDC_OUT1
NetEmergency_Buzzer#1_1: Emergency_Buzzer#1.1 Emergency_Buzzer#2.GND RUN?#3.?39(Emergency_Buzzer) 低压盒.?31(Emergency_Buzzer)
NetHV_Box_12V: HV_Box.12V 放电继电器#2.4 电压传感器.12V ; port 电池箱_SDC_OUT2
NetHV_Box_24V: HV_Box.24V 电流传感器.24V(I_out) 能量计.24V
NetHV_Box_?1: HV_Box.?1(TSMP+) 人体保护电阻+.1 ; port HV+
NetHV_Box_?2: HV_Box.?2(TSMP-) 人体保护电阻-.1 ; port HV-
NetHV_Box_?3: HV_Box.?3 HV_Box.?4 HV_Box.HV+ 电流传感器.HV+
NetHV_Box_CANAH: HV_Box.CANAH 能量计.CANA_H
NetHV_Box_CANAL: HV_Box.CANAL 能量计.CANA_L
NetHV_Box_CurrentSensor: HV_Box.CurrentSensor 电流传感器.I_out ; port BSPD_I_IN_IN
NetHV_Box_GND: HV_Box.GND 电压传感器.GND 电流传感器.GND 能量计.GND
NetHV_Box_HV+: HV_Box.HV+(Vol_Sensor) 人体保护电阻+.2 放电继电器#2.1 电压传感器.HV+ 电机控制器.HV+ 电流传感器.HV+ 能量计.HV+
NetHV_Box_HV-: HV_Box.HV-(Vol_Sensor) PV.2 电机控制器.HV- 能量计.HV-
NetHV_Box_HV-: HV_Box.HV- 人体保护电阻-.2 放电电阻1.1 放电电阻2.1 能量计.HV-  [a separate net that carries the same name]
NetHV_Box_Vol_Sensor: HV_Box.Vol_Sensor 电压传感器.V_out ; port LVBox_V_Controlled_IN
NetHV_Box_Vol_Sensor: HV_Box.Vol_Sensor(K2-) 放电继电器#2.3 ; port BMS_K2-_IN  [a separate net that carries the same name]
NetIMD锁存复位_2: IMD锁存复位.2 ; port LVBox_IMD_Rst_IN
NetLED_BMS_Error_1: LED_BMS_Error.1 RUN?#3.?53(LED_BMS_Error) 低压盒.?48(LED_BMS_Error) ; port 仪表盘_BMS_Error_IN
NetLED_Brake#1_2: LED_Brake#1.2 LED_Brake#2.1(A) RUN?#3.?38(LED_Brake) 低压盒.?30(LED_Brake)
NetLED_EBS_Error_1: LED_EBS_Error.1 RUN?#3.?41(LED_EBS_Error) 低压盒.?33(LED_EBS_Error) ; port 仪表盘_EBS_Error_IN
NetLED_IMD_Error_1: LED_IMD_Error.1 RUN?#3.?54(LED_IMD_Error) 低压盒.?49(LED_IMD_Error) ; port 仪表盘_IMD_Error_IN
NetLVMS#2_1: LVMS#2.1 ; port BSPD_SDC_IN, port 24V供电
NetLVMS#2_2: LVMS#2.2 低压电池.24V
NetPV_1: PV.1 电压传感器.HV-
NetR2D_Buzzer#1_1: R2D_Buzzer#1.1 R2D_Buzzer#2.GND RUN?#3.?40(R2D_Buzzer) 低压盒.?32(R2D_Buzzer)
NetR?#12_2: R?#12.2 RUN?#3.?50(ShutdownE_IN) 低压盒.?47(ShutdownE_LIN) ; port 急停开关_左_OUT
NetR?#13_2: R?#13.2 RUN?#3.?49(ShutdownS_IN) 低压盒.?46(ShutdownS_LIN) ; port 急停开关_中_IN
NetRES#2_Kj1_IN: RES#2.Kj1_IN(24V) ; port 24V供电_OUT
NetRES#2_Kj1_OUT: RES#2.Kj1_OUT(EBS_PWR) ; port EBS_PWR_IN
NetRES#2_Kj2_OUT: RES#2.Kj2_OUT(SDC) 惯性开关.2 ; port OSDC_ASRL
NetRUN#2_1: RUN#2.1 RUN?#3.?43(RUN) 低压盒.?35(RUN) ; port 电机控制器_Wakeup
NetRUN#3_2: RUN#3.2 ; port RUN_Button_IN
NetRUN?#3_12V: RUN?#3.12V 低压盒.+12
NetRUN?#3_?10: RUN?#3.?10(PRE_Actual) TSAL_PCB.PRE_Actual 低压盒.?16(PRE_Actual)
NetRUN?#3_?11: RUN?#3.?11(MN_Actual) TSAL_PCB.MN_Actual 低压盒.?15(MN_Actual)
NetRUN?#3_?12: RUN?#3.?12(MP_Actual) TSAL_PCB.MP_Actual 低压盒.?14(MP_Actual)
NetRUN?#3_?13: RUN?#3.?13(V_Controlled) TSAL_PCB.V_Controlled 低压盒.?50(V_Controlled) ; port HVBox_Vol_Sensor_OUT
NetRUN?#3_?14: RUN?#3.?14(MainP) TSAL_PCB.MP 低压盒.?12(MainP)
NetRUN?#3_?15: RUN?#3.?15(MainN) TSAL_PCB.MN 低压盒.?11(MainN)
NetRUN?#3_?16: RUN?#3.?16(PreCharge) TSAL_PCB.PreC 低压盒.?10(PreCharge)
NetRUN?#3_?25: RUN?#3.?25(TSAL_R) TSAL_PCB.RED_OUT TSAL_R.2(K) 低压盒.?17(TSAL_R)
NetRUN?#3_?26: RUN?#3.?26(TSAL_G) TSAL_G.2(K) TSAL_PCB.GREEN_OUT 低压盒.?18(TSAL_G) ; port TS_off_LED_IN
NetRUN?#3_?58: RUN?#3.?58(V_Battery) TSAL_PCB.V_Battery 低压盒.?13(V_Battery)
NetRUN?#3_GND: RUN?#3.GND 低压盒.GND
NetRXG?_1: RXG?.1 预充继电器?#2.2
NetTS_off_LED_1: TS_off_LED.1(A) ; port TSAL_G_OUT
NetTSMS#2_1: TSMS#2.1 ; port 电池箱_IN
NetTSMS#2_2: TSMS#2.2 ; port HVD_OUT
Net主正继电器?#2_4: 主正继电器?#2.4 主正继电器?#2.6 主负继电器?#2.4 主负继电器?#2.6 预充继电器?#2.4 预充继电器?#2.6 ; port TSMS_OUT, port EBS_SDC_IN, port 放电继电器_12V_IN
Net急停_右_1: 急停_右.1 ; port 急停_中_OUT
Net急停_左_1: 急停_左.1 ; port 急停_右_OUT
Net放电电阻1_2: 放电电阻1.2 放电电阻2.2 放电继电器#2.2
Net电机控制器_2: 电机控制器.2(Wakeup) ; port LVBox_RUN_OUT
Net驾驶舱急停开关_1: 驾驶舱急停开关.1 ; port HV_Err_OUT, port ShutdownS_IN

Not connected (* = marked no-connect by the designer): *#17 GND V+ V-; *?#15 BDU_CANH BDU_CANL; *?#16 HV-; *?#17 HALL1(Wlspd_Sensor1) HALL2(Wlspd_Sensor2) O7(DI8) SW7(Shutdown_Start); ?#2 12V CANB_H CANB_L GND; ?#3 1 2; ?#5 12V GND; APPS GND1 GND2 Vcc1 Vcc2; AS_Reset 1; BMS_LED 1(A) 2(K); BMS故障消除 1 2; BMS锁存复位 1; BSPD#2 24V GND; Bussmann_FWH-? 1; DI8#1 1 2; DI8#3 1; EBS GND; EBS_Error_LED 2(K); EBS_Release 1 2; HVBox_BMS_Error_OUT 12V CANB_H CANB_L GND; IMD_LED 1(A) 2(K); IMD锁存复位 1; Littelfuse_?#1 2; Littelfuse_?#2 2; PV-?#1 2; PV-?#2 2; R?#13 1; RES#2 12V(ASMS) CANBH CANBL GND; RUN#1 1 2; RUN#3 1; RUN?#3 ?18(ASSI_Y) ?19(LED_Brake) ?20(Emergency_Buzzer) ?21(R2D_Buzzer) ?22(LED_EBS_Error) ?24(RUN) ?45(ASMS) ?46(TSMS) ?51(Shutdown_Start) ?55(LED_BMS); TS_off_LED 2(K); TSAL_G 1(A); TSAL_R 1(A); 急停_右 2; 气压传感器1 GND V+ V-; 水泵开关 1 2; 油压传感器 GND V+ V- V_OUT; 电机控制器 1(PWR+) 7(Ext+) 8(sin) 9(cos) 10(MTmp2+) 13(PGND) 14(CANAH) 15(CANAL) 19(Ext-) 20(sin+) 21(cos-) 22(MTmp2-) 23(MTmp1+) 24(MTmp1-) 26(CANA_TERM) 29(HVIL_IN) 30(HVIL_OUT) 35(ENCLOSURE); 电池箱低压插头 MainN MainP MN_Actual MP_Actual PRE_Actual PreCharge V_Battery; 角位移 GND Vcc; 驾驶舱急停开关 2

### Notes on the sheet
- 电机
- (near 电机控制器) 电机控制器
- (near HV_Box) TSMP
- (near HV_Box) HVD
- IMD_Err锁存
- RL9080-101-F1OR
- 维护插头：
- Amphenol
- 和RL00801-35BK
- 维护插头连接线径35mm²
- (near Bussmann_FWH-?) 保险丝距电源侧线缆约5cm
- 3mm
- 12V安全回路（来自TSMS）
- (near Bussmann_FWH-?) 铜鼻压接 500V/60A
- (near *?#12) 3mm
- (near 预充继电器?#2) 35mm²
- (near Bussmann_PV-?) 铜鼻压接 1000V/5A
- -
- 模组1
- +
- 模组2
- 模组3
- (near *?#12) 模组4
- (near *?#12) +
- 35mm²
- （23块电芯）
- (near *?#12) （23块电芯）
- (near *?#12) 0.5mm²
- (near *?#12) 0.75mm²
- 0.75mm²
- (near 主正继电器?#2) 0.75mm²
- 电压采集点4*23
- (near Littelfuse_?#1) 0.75mm²
- (near *?#15) 温度采集点4*8
- (near *?#15) 0.75mm²
- (near 主负继电器?#2) 35mm²
- 0.2mm²
- 低压插头互锁
- 电池箱主接插件
- (near *?#14) 0.75mm²
- 0.5mm²
- (near *?#14) 0.5mm²
- (near 主负继电器?#2) 0.75mm²
- (near *?#15) 0.5mm²
- (near PV-?#1) 保险丝距HV+线缆6cm
- (near PV-?#1) 即未保护线缆6cm
- (near ?#3) 91C4表头(电压指示器)
- (near ?#3) 0.75mm²
- (near ?#3) BD100-DV/V-C12
- 电压传感器
- V
- BMS_Err锁存
- (near 低压盒) 低压盒
- (in symbol 侧面板右) AMI
- (in symbol 驾驶舱面板) 仪表盘

### Library data of the parts
*#17 气压传感器1 = 油压传感器
?#3 = Resistor: as 91C4内部电阻#1 on sheet 电池箱内部原理图; TC2: 0
?#4 = SPST Relay NC: as AS继电器 on sheet 安全回路
AS_Reset ASMS#2 BMS故障消除 BMS锁存复位 DI8#1 DI8#3 EBS_Release IMD锁存复位 LVMS#2 RUN#1 RUN#3 TSMS#2 水泵开关 = SW NO: as ASMS? on sheet Bench
ASRC ASSI_B#1 ASSI_Y#1 DI8#2 Emergency_Buzzer#1 LED_BMS_Error LED_Brake#1 LED_EBS_Error LED_IMD_Error R2D_Buzzer#1 RUN#2 放电继电器#2 = SPST Relay NO: as ASSI_B? on sheet Bench
ASSI_B#2 ASSI_Y#2 BMS_LED EBS_Error_LED IMD_LED LED_Brake#2 TS_off_LED TSAL_G TSAL_R = LED: as D?#1 on sheet Bench; CJO: 0; CJP: 0; CTA: 0; CTP: 0; FCS: 0.5; FV_MAX: 1e99; IKF: 0; IKR: 0; ISR: 1e-14; JSW: 0; JTUN: 0; JTUNSW: 0; KEG: 1; KF: 0; LEVEL: 1; N: 1; NBV: 1; NR: 1; NS: 1; PHP: 1; RS: 0; TCV: 0; TLEV: 0; TLEVC: 0; TM1: 0; TM2: 0; TPB: 0; TPHP: 0; TRS: 0; TRS2: 0; TT: 0; TTT1: 0; TTT2: 0; VJ: 1; XTITUN: 3
BOTS#2 急停_右 急停_左 惯性开关 驾驶舱急停开关 = SW NC: as BOTS? on sheet Bench
Bussmann_FWH-? Bussmann_PV-? PV PV-?#1 PV-?#2 = Fuse: as PV-2A10F on sheet 箱外驱动系统
D?#18 D?#19 = Diode: as D?#4 on sheet Bench; CJO: 0; CJP: 0; CTA: 0; CTP: 0; FCS: 0.5; FV_MAX: 1e99; IKF: 0; IKR: 0; JSW: 0; JTUN: 0; JTUNSW: 0; KEG: 1; KF: 0; LEVEL: 1; N: 1; NBV: 1; NR: 1; NS: 1; PHP: 1; RS: 0; TCV: 0; TLEV: 0; TLEVC: 0; TM1: 0; TM2: 0; TPB: 0; TPHP: 0; TRS: 0; TRS2: 0; TT: 0; TTT1: 0; TTT2: 0; VJ: 1; XTITUN: 3; IS: 1e-14
HV_Box = HV_Box
Littelfuse_?#1 Littelfuse_?#2 = Fuse: as Bussmann_FWP-60C#1 on sheet 箱外驱动系统
R?#12-R?#15 RXG? 人体保护电阻+ 人体保护电阻- 放电电阻1 放电电阻2 = Resistor: TC1: 0; SimulationGenericComponent: True; TC2: 0
主正继电器?#2 主负继电器?#2 预充继电器?#2 = DPST Relay: as ISDC_ASRL? on sheet Bench
低压盒 = Low_Vol_Box_New

## Nets that join several sheets
+12: Bench (Emergency_Buzzer?#2.+12 R?#4.1), 电气拓扑 (11 pins)
+24: Bench (6 pins), 安全回路 (ASMS#1.2 BSPD#1.1 LVMS#1.2), 电气拓扑 (ASMS#2.2)
GND: Bench (29 pins), 箱外驱动系统 (HVR1B12.5), 电池箱内部原理图 (5 pins), 安全回路 (9 pins), 充电安全回路 (6 pins), TSAL分布图 (GREEN_TSAL.2 RED_TSAL.2 TS_off.2), 电气拓扑 (25 pins)